# EAGLE board GDPHS_VGA - v2.2.1 (EAGLE 7.3.0), part 1 of 2
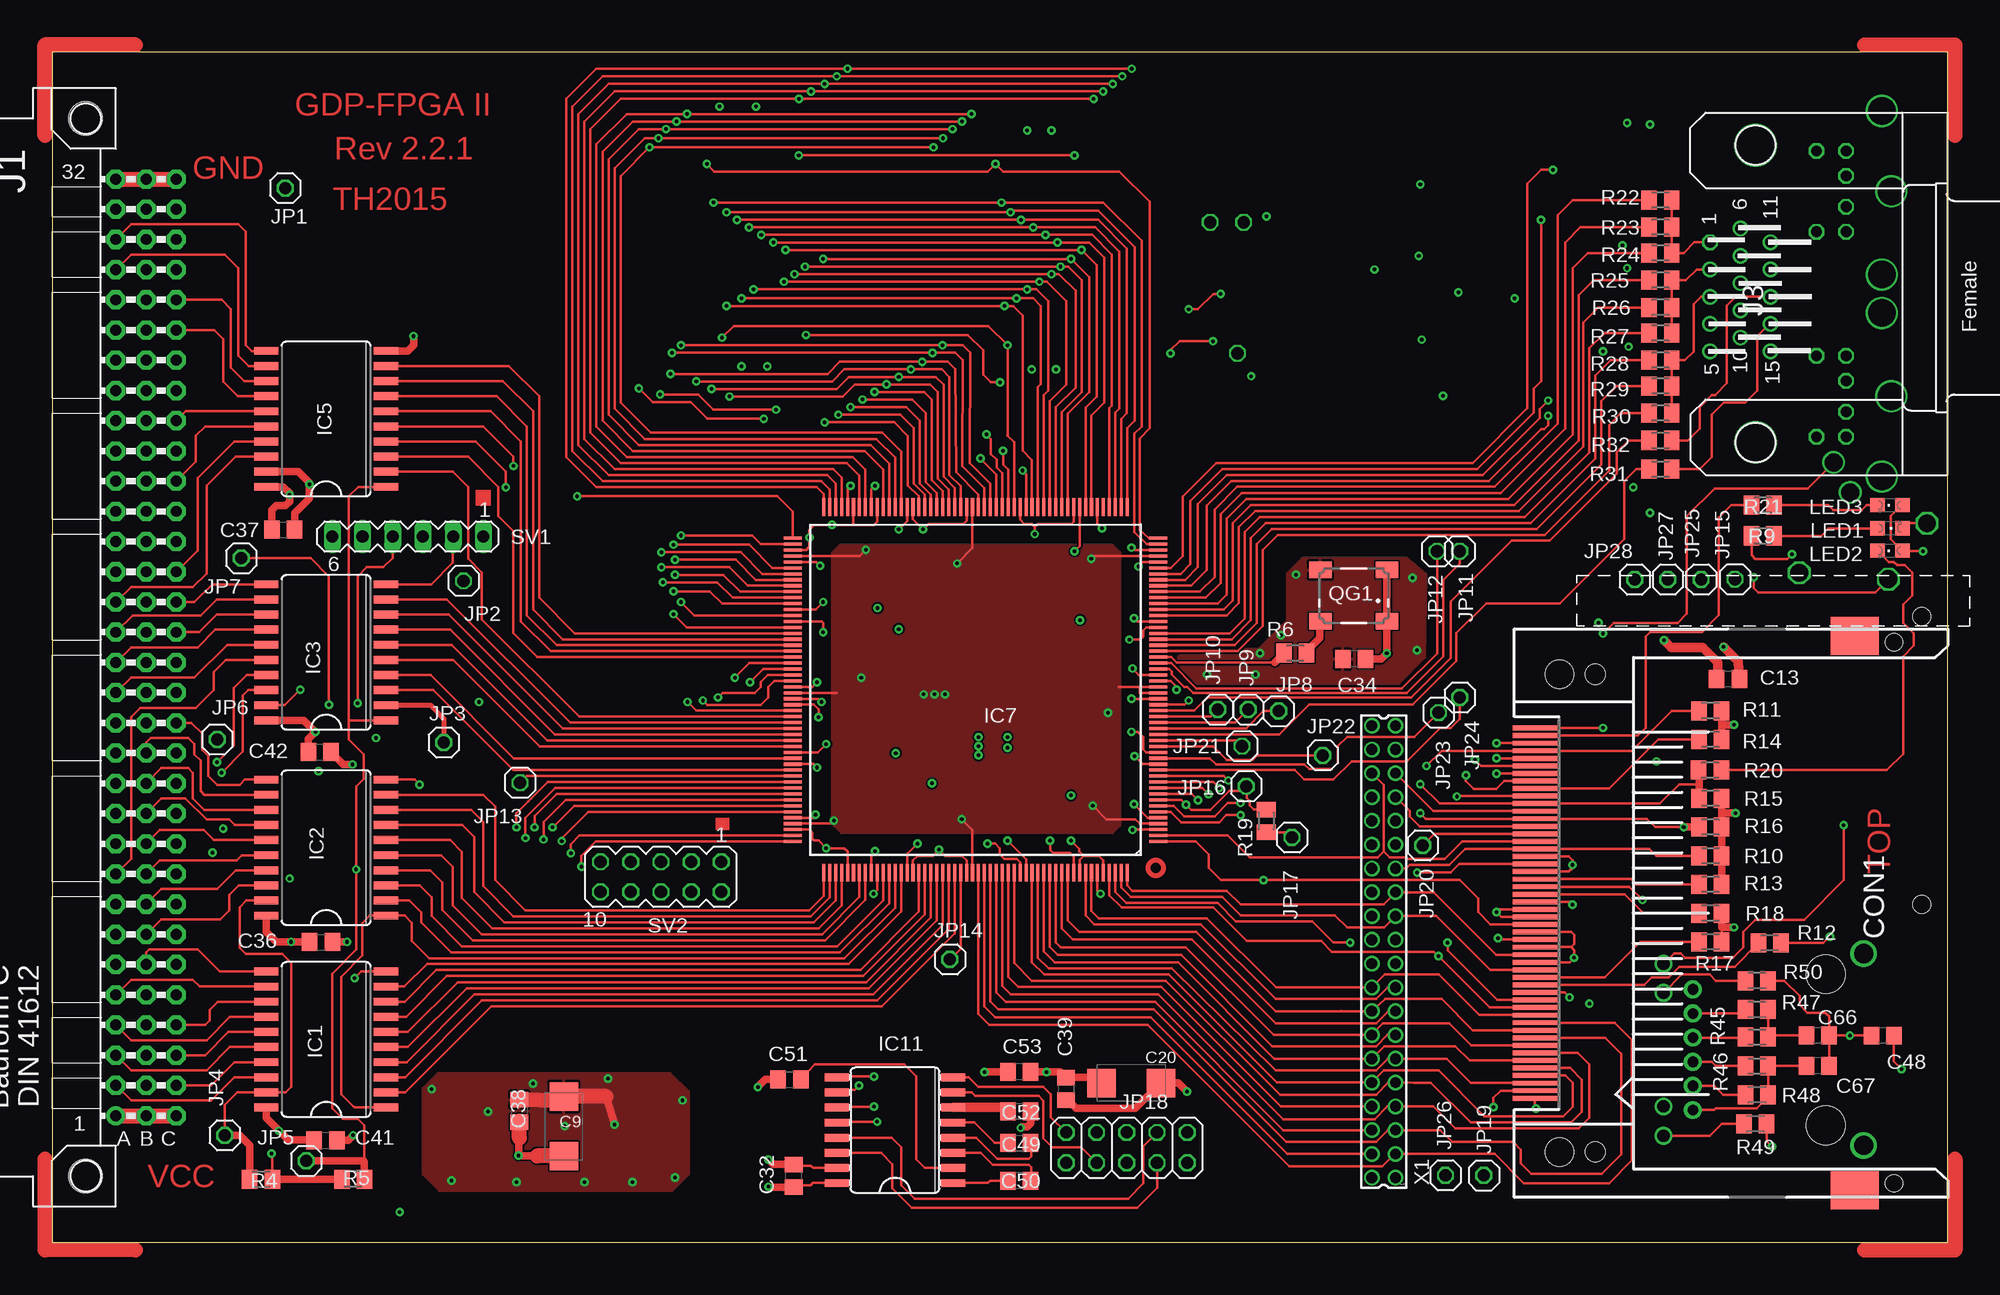
[diagram p5: board, top side]
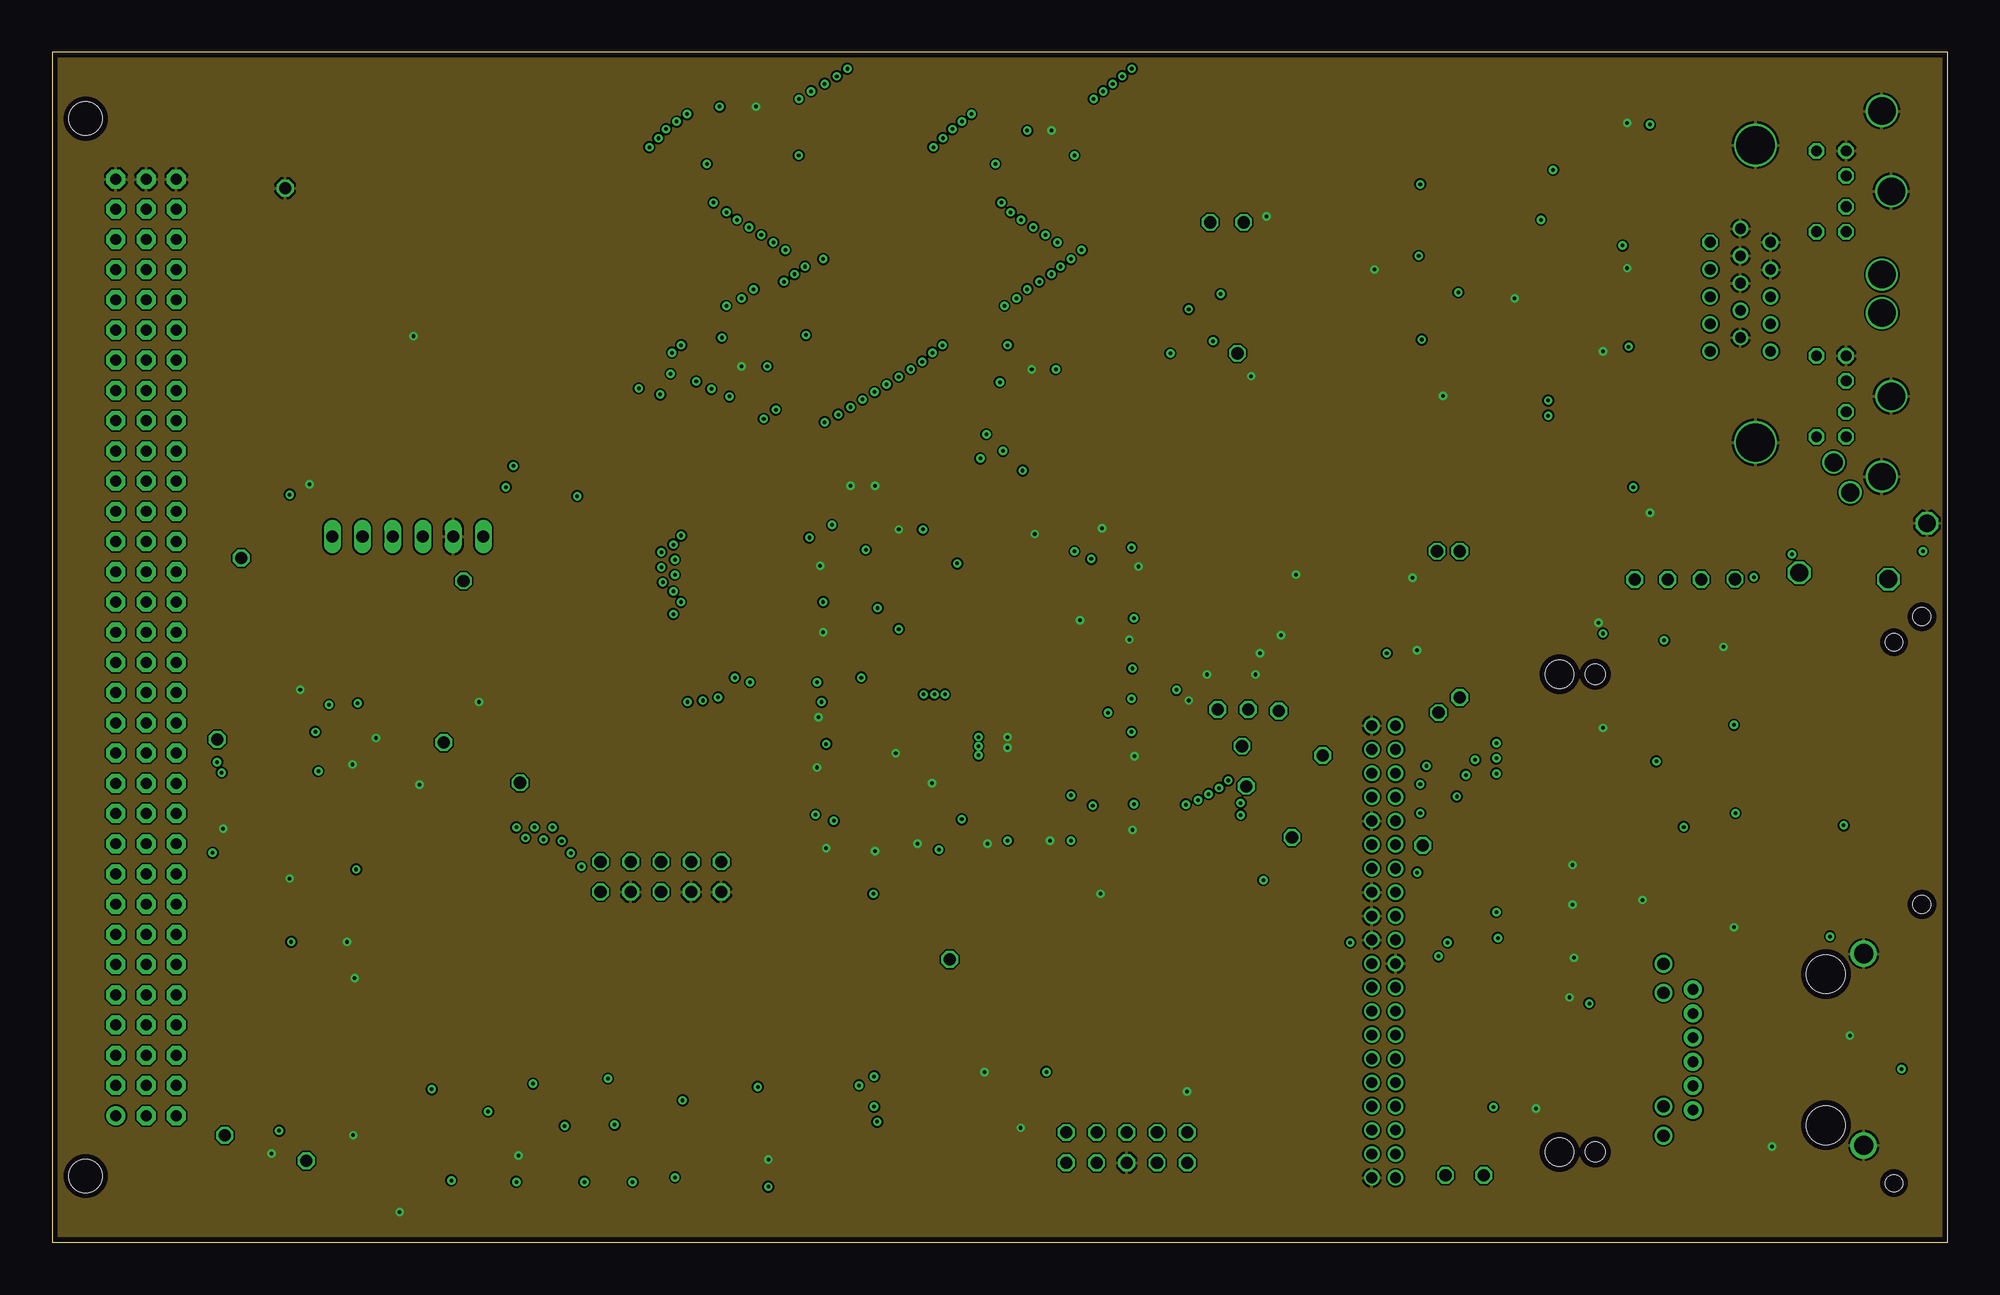
[diagram p6: board, inner layer GND$]
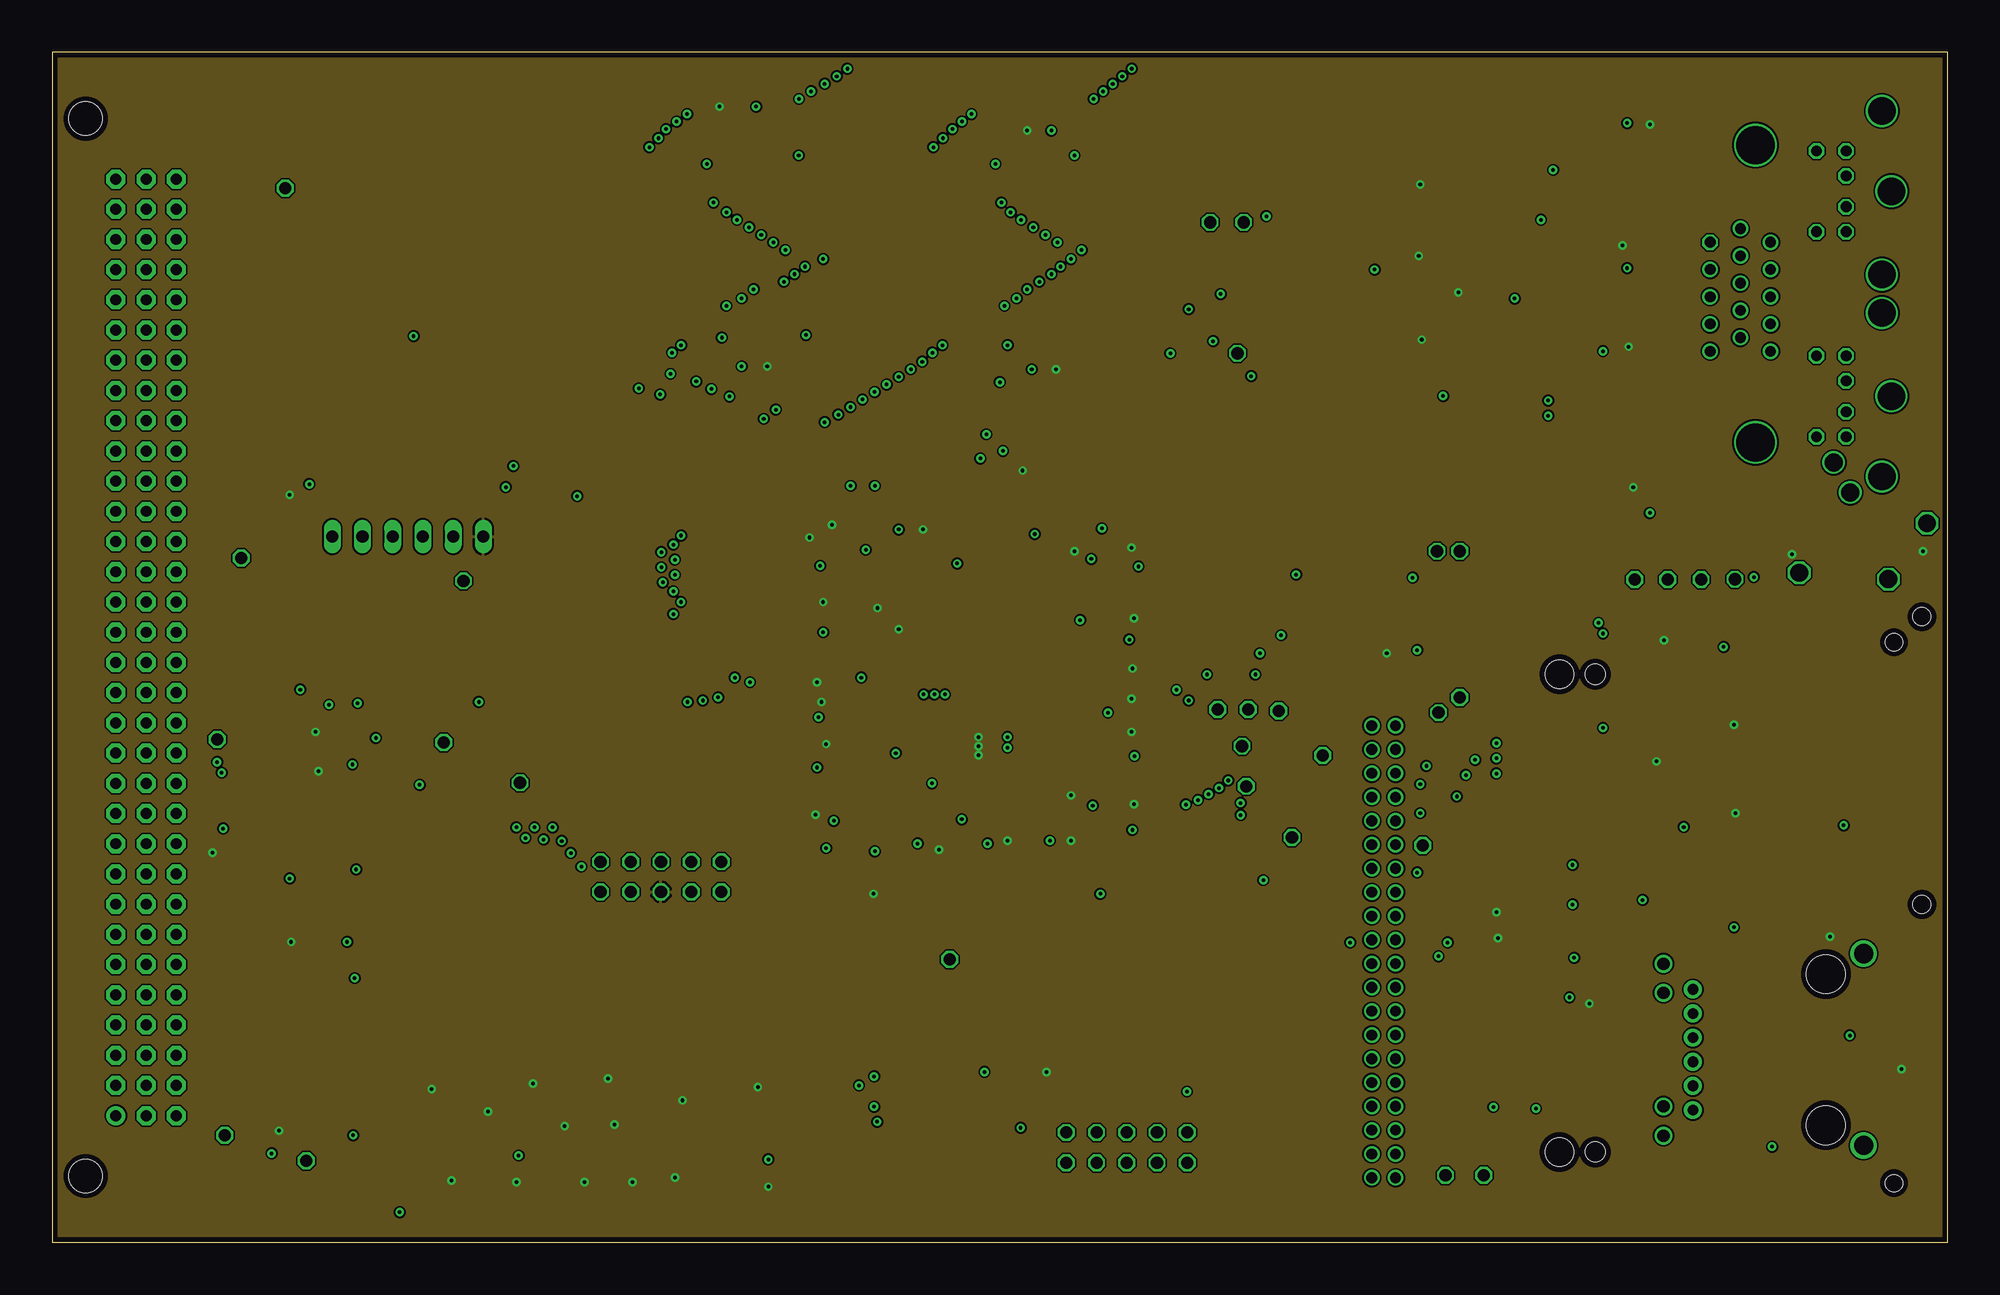
[diagram p7: board, inner layer VCC$]
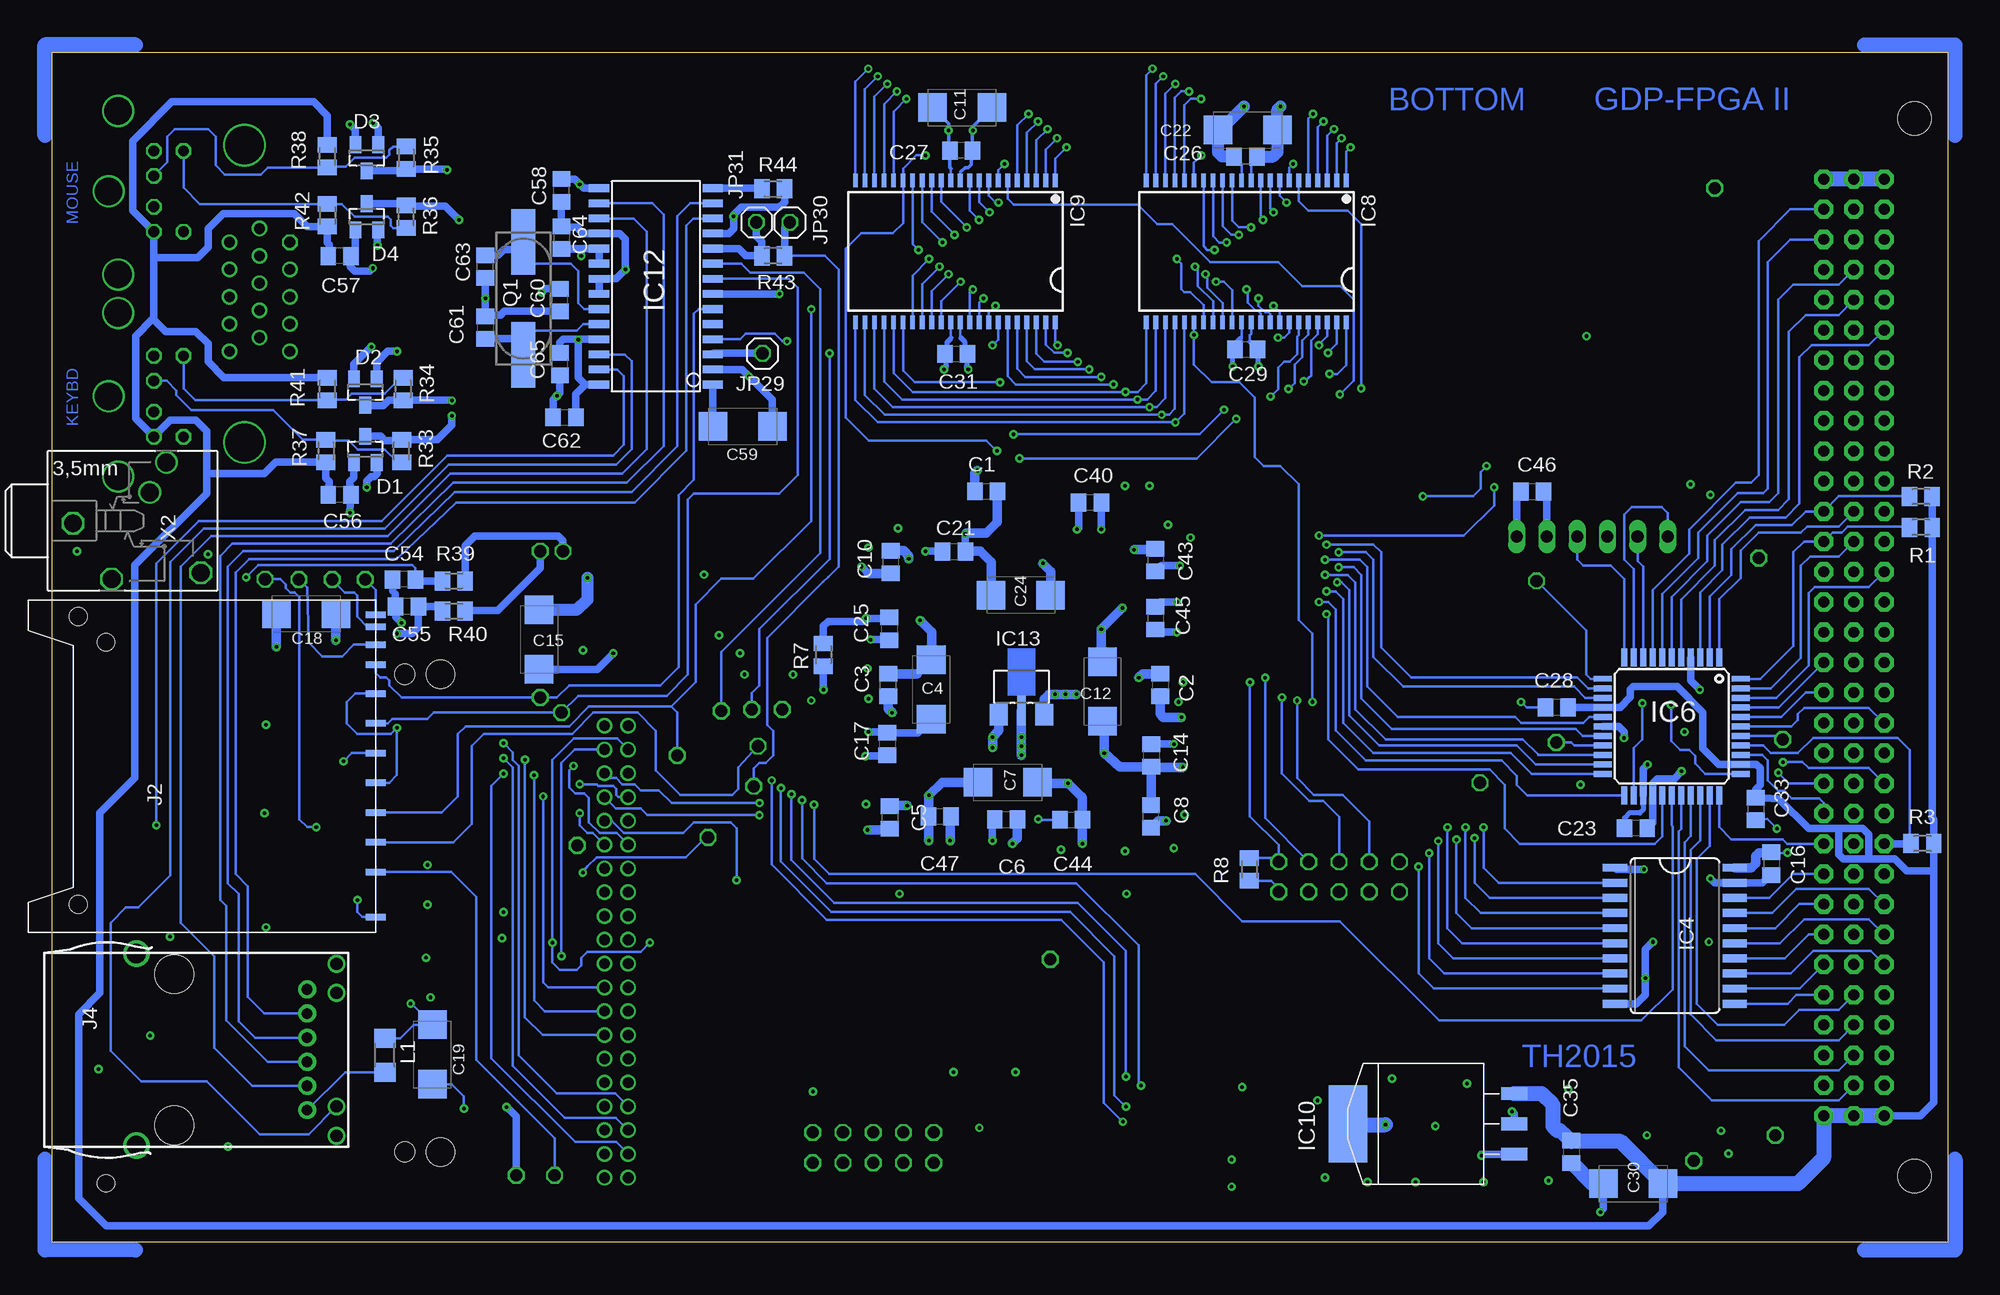
[diagram p8: board, bottom side, seen from below]

Size 159.26 x 100.03 mm. Coordinates in mm from the lower left corner, seen from the top.
Copper layers (1*2*3*16): Top 0.018mm / dielectric 0.36mm / GND$ 0.035mm / dielectric 0.71mm / VCC$ 0.035mm / dielectric 0.36mm / Bottom 0.018mm
Design rules "eC-PCB_proto-4-layer": minimum track width 0.15mm, minimum drill 0.25mm, track to track 0.15mm, track to pad 0.15mm, pad to pad 0.15mm, via to via 0.15mm, smd to smd 0.15mm, copper to edge 0.45mm, drill to drill 0.3mm, minimum pad ring 0.2mm, minimum via ring 0.2mm, stop-mask expansion 0.1mm, vias tented up to drill 0mil, thermal gap 0.2mm

## Footprints (pad centres in the part's own frame; a part is rotated, then mirrored left to right if it is on the bottom)
C0805 = smd 1.3 x 1.5: 1 -0.95,0; 2 0.95,0
SMC_C = smd 2.4 x 2.4: + -2.5,0; - 2.5,0
CF-050-P2-X03-10-DS-1 = smd 0.41 x 3.75: 1 15.557,0.27; 2 14.287,0.27; 3 13.018,0.27; 4 11.748,0.27; 5 10.477,0.27; 6 9.207,0.27; 7 7.938,0.27; 8 6.668,0.27; 9 5.397,0.27; 10 4.128,0.27; 11 2.857,0.27; 12 1.587,0.27; 13 0.318,0.27; 14 -0.953,0.27; 15 -2.223,0.27; 16 -3.493,0.27; 17 -4.763,0.27; 18 -6.032,0.27; 19 -7.303,0.27; 20 -8.572,0.27; 21 -9.842,0.27; 22 -11.113,0.27; 23 -12.383,0.27; 24 -13.652,0.27; 25 -14.922,0.27; 26 14.922,0.27; 27 13.652,0.27; 28 12.383,0.27; 29 11.113,0.27; 30 9.842,0.27; 31 8.572,0.27; 32 7.303,0.27; 33 6.032,0.27; 34 4.763,0.27; 35 3.493,0.27; 36 2.223,0.27; 37 0.953,0.27; 38 -0.318,0.27; 39 -1.587,0.27; 40 -2.857,0.27; 41 -4.128,0.27; 42 -5.397,0.27; 43 -6.668,0.27; 44 -7.938,0.27; 45 -9.207,0.27; 46 -10.477,0.27; 47 -11.748,0.27; 48 -13.018,0.27; 49 -14.287,0.27; 50 -15.557,0.27 | smd 3.2 x 4: M1 -23.3,27.15; M2 23.3,27.15 | hole 1.676: 20.08,5.35; -20.08,5.35 | hole 1.422: -22.77,30.45; 22.7,30.45 | hole 2.4: -20.08,2.35; 20.08,2.35
SOT23 = smd 1 x 1.4: 1 -0.95,-1.1; 2 0.95,-1.1; 3 0,1.1
SO20W = smd 0.66 x 2.032: 1 -5.715,-5.029; 2 -4.445,-5.029; 3 -3.175,-5.029; 4 -1.905,-5.029; 5 -0.635,-5.029; 6 0.635,-5.029; 7 1.905,-5.029; 8 3.175,-5.029; 9 4.445,-5.029; 10 5.715,-5.029; 11 5.715,5.029; 12 4.445,5.029; 13 3.175,5.029; 14 1.905,5.029; 15 0.635,5.029; 16 -0.635,5.029; 17 -1.905,5.029; 18 -3.175,5.029; 19 -4.445,5.029; 20 -5.715,5.029
TQFP44 = smd 1.5 x 0.5: 1 -5.8,4; 2 -5.8,3.2; 3 -5.8,2.4; 4 -5.8,1.6; 5 -5.8,0.8; 6 -5.8,0; 7 -5.8,-0.8; 8 -5.8,-1.6; 9 -5.8,-2.4; 10 -5.8,-3.2; 11 -5.8,-4; 23 5.8,-4; 24 5.8,-3.2; 25 5.8,-2.4; 26 5.8,-1.6; 27 5.8,-0.8; 28 5.8,0; 29 5.8,0.8; 30 5.8,1.6; 31 5.8,2.4; 32 5.8,3.2; 33 5.8,4 | smd 0.5 x 1.5: 12 -4,-5.8; 13 -3.2,-5.8; 14 -2.4,-5.8; 15 -1.6,-5.8; 16 -0.8,-5.8; 17 0,-5.8; 18 0.8,-5.8; 19 1.6,-5.8; 20 2.4,-5.8; 21 3.2,-5.8; 22 4,-5.8; 34 4,5.8; 35 3.2,5.8; 36 2.4,5.8; 37 1.6,5.8; 38 0.8,5.8; 39 0,5.8; 40 -0.8,5.8; 41 -1.6,5.8; 42 -2.4,5.8; 43 -3.2,5.8; 44 -4,5.8
PQFP_208 = smd 1.5 x 0.26: 1 -15.367,12.75; 2 -15.367,12.25; 3 -15.367,11.75; 4 -15.367,11.25; 5 -15.367,10.75; 6 -15.367,10.25; 7 -15.367,9.75; 8 -15.367,9.25; 9 -15.367,8.75; 10 -15.367,8.25; 11 -15.367,7.75; 12 -15.367,7.25; 13 -15.367,6.75; 14 -15.367,6.25; 15 -15.367,5.75; 16 -15.367,5.25; 17 -15.367,4.75; 18 -15.367,4.25; 19 -15.367,3.75; 20 -15.367,3.25; 21 -15.367,2.75; 22 -15.367,2.25; 23 -15.367,1.75; 24 -15.367,1.25; 25 -15.367,0.75; 26 -15.367,0.25; 27 -15.367,-0.25; 28 -15.367,-0.75; 29 -15.367,-1.25; 30 -15.367,-1.75; 31 -15.367,-2.25; 32 -15.367,-2.75; 33 -15.367,-3.25; 34 -15.367,-3.75; 35 -15.367,-4.25; 36 -15.367,-4.75; 37 -15.367,-5.25; 38 -15.367,-5.75; 39 -15.367,-6.25; 40 -15.367,-6.75; 41 -15.367,-7.25; 42 -15.367,-7.75; 43 -15.367,-8.25; 44 -15.367,-8.75; 45 -15.367,-9.25; 46 -15.367,-9.75; 47 -15.367,-10.25; 48 -15.367,-10.75; 49 -15.367,-11.25; 50 -15.367,-11.75; 51 -15.367,-12.25; 52 -15.367,-12.75; 105 15.367,-12.75; 106 15.367,-12.25; 107 15.367,-11.75; 108 15.367,-11.25; 109 15.367,-10.75; 110 15.367,-10.25; 111 15.367,-9.75; 112 15.367,-9.25; 113 15.367,-8.75; 114 15.367,-8.25; 115 15.367,-7.75; 116 15.367,-7.25; 117 15.367,-6.75; 118 15.367,-6.25; 119 15.367,-5.75; 120 15.367,-5.25; 121 15.367,-4.75; 122 15.367,-4.25; 123 15.367,-3.75; 124 15.367,-3.25; 125 15.367,-2.75; 126 15.367,-2.25; 127 15.367,-1.75; 128 15.367,-1.25; 129 15.367,-0.75; 130 15.367,-0.25; 131 15.367,0.25; 132 15.367,0.75; 133 15.367,1.25; 134 15.367,1.75; 135 15.367,2.25; 136 15.367,2.75; 137 15.367,3.25; 138 15.367,3.75; 139 15.367,4.25; 140 15.367,4.75; 141 15.367,5.25; 142 15.367,5.75; 143 15.367,6.25; 144 15.367,6.75; 145 15.367,7.25; 146 15.367,7.75; 147 15.367,8.25; 148 15.367,8.75; 149 15.367,9.25; 150 15.367,9.75; 151 15.367,10.25; 152 15.367,10.75; 153 15.367,11.25; 154 15.367,11.75; 155 15.367,12.25; 156 15.367,12.75 | smd 0.26 x 1.5: 53 -12.75,-15.367; 54 -12.25,-15.367; 55 -11.75,-15.367; 56 -11.25,-15.367; 57 -10.75,-15.367; 58 -10.25,-15.367; 59 -9.75,-15.367; 60 -9.25,-15.367; 61 -8.75,-15.367; 62 -8.25,-15.367; 63 -7.75,-15.367; 64 -7.25,-15.367; 65 -6.75,-15.367; 66 -6.25,-15.367; 67 -5.75,-15.367; 68 -5.25,-15.367; 69 -4.75,-15.367; 70 -4.25,-15.367; 71 -3.75,-15.367; 72 -3.25,-15.367; 73 -2.75,-15.367; 74 -2.25,-15.367; 75 -1.75,-15.367; 76 -1.25,-15.367; 77 -0.75,-15.367; 78 -0.25,-15.367; 79 0.25,-15.367; 80 0.75,-15.367; 81 1.25,-15.367; 82 1.75,-15.367; 83 2.25,-15.367; 84 2.75,-15.367; 85 3.25,-15.367; 86 3.75,-15.367; 87 4.25,-15.367; 88 4.75,-15.367; 89 5.25,-15.367; 90 5.75,-15.367; 91 6.25,-15.367; 92 6.75,-15.367; 93 7.25,-15.367; 94 7.75,-15.367; 95 8.25,-15.367; 96 8.75,-15.367; 97 9.25,-15.367; 98 9.75,-15.367; 99 10.25,-15.367; 100 10.75,-15.367; 101 11.25,-15.367; 102 11.75,-15.367; 103 12.25,-15.367; 104 12.75,-15.367; 157 12.75,15.367; 158 12.25,15.367; 159 11.75,15.367; 160 11.25,15.367; 161 10.75,15.367; 162 10.25,15.367; 163 9.75,15.367; 164 9.25,15.367; 165 8.75,15.367; 166 8.25,15.367; 167 7.75,15.367; 168 7.25,15.367; 169 6.75,15.367; 170 6.25,15.367; 171 5.75,15.367; 172 5.25,15.367; 173 4.75,15.367; 174 4.25,15.367; 175 3.75,15.367; 176 3.25,15.367; 177 2.75,15.367; 178 2.25,15.367; 179 1.75,15.367; 180 1.25,15.367; 181 0.75,15.367; 182 0.25,15.367; 183 -0.25,15.367; 184 -0.75,15.367; 185 -1.25,15.367; 186 -1.75,15.367; 187 -2.25,15.367; 188 -2.75,15.367; 189 -3.25,15.367; 190 -3.75,15.367; 191 -4.25,15.367; 192 -4.75,15.367; 193 -5.25,15.367; 194 -5.75,15.367; 195 -6.25,15.367; 196 -6.75,15.367; 197 -7.25,15.367; 198 -7.75,15.367; 199 -8.25,15.367; 200 -8.75,15.367; 201 -9.25,15.367; 202 -9.75,15.367; 203 -10.25,15.367; 204 -10.75,15.367; 205 -11.25,15.367; 206 -11.75,15.367; 207 -12.25,15.367; 208 -12.75,15.367
TSOP44-400 = smd 0.406 x 1.143: 1 -10.4,-5.969; 2 -9.6,-5.969; 3 -8.8,-5.969; 4 -8,-5.969; 5 -7.2,-5.969; 6 -6.4,-5.969; 7 -5.6,-5.969; 8 -4.8,-5.969; 9 -4,-5.969; 10 -3.2,-5.969; 11 -2.4,-5.969; 12 -1.6,-5.969; 13 -0.8,-5.969; 14 0,-5.969; 15 0.8,-5.969; 16 1.6,-5.969; 17 2.4,-5.969; 18 3.2,-5.969; 19 4,-5.969; 20 4.8,-5.969; 21 5.6,-5.969; 22 6.4,-5.969; 23 6.4,5.969; 24 5.6,5.969; 25 4.8,5.969; 26 4,5.969; 27 3.2,5.969; 28 2.4,5.969; 29 1.6,5.969; 30 0.8,5.969; 31 0,5.969; 32 -0.8,5.969; 33 -1.6,5.969; 34 -2.4,5.969; 35 -3.2,5.969; 36 -4,5.969; 37 -4.8,5.969; 38 -5.6,5.969; 39 -6.4,5.969; 40 -7.2,5.969; 41 -8,5.969; 42 -8.8,5.969; 43 -9.6,5.969; 44 -10.4,5.969
MDD = smd 1.067 x 2.184: 1 0,0; 2 2.54,0; 3 5.08,0 | smd 6.452 x 3.251: 4 2.54,13.97
SO16L = smd 0.66 x 2.032: 1 -4.445,-4.902; 2 -3.175,-4.902; 3 -1.905,-4.902; 4 -0.635,-4.902; 5 0.635,-4.902; 6 1.905,-4.902; 7 3.175,-4.902; 8 4.445,-4.902; 9 4.445,4.902; 10 3.175,4.902; 11 1.905,4.902; 12 0.635,4.902; 13 -0.635,4.902; 14 -1.905,4.902; 15 -3.175,4.902; 16 -4.445,4.902
SO28W = smd 0.65 x 1.7: 1 -7.62,-4.78; 2 -6.35,-4.78; 3 -5.08,-4.78; 4 -3.81,-4.78; 5 -2.54,-4.78; 6 -1.27,-4.78; 7 0,-4.78; 8 1.27,-4.78; 9 2.54,-4.78; 10 3.81,-4.78; 11 5.08,-4.78; 12 6.35,-4.78; 13 7.62,-4.78; 14 8.89,-4.78; 15 8.89,4.78; 16 7.62,4.78; 17 6.35,4.78; 18 5.08,4.78; 19 3.81,4.78; 20 2.54,4.78; 21 1.27,4.78; 22 0,4.78; 23 -1.27,4.78; 24 -2.54,4.78; 25 -3.81,4.78; 26 -5.08,4.78; 27 -6.35,4.78; 28 -7.62,4.78
SOT89-W = smd 1.5 x 1.8: 1 1.9,-2.1; 2 -1.9,-2.1 | smd 0.7 x 2.55: 4 0,-1.73
VG96K = drill 0.914 pad 1.6: A1 154.94,39.37 | drill 0.914 pad 1.6 octagon: A2 154.94,36.83; A3 154.94,34.29; A4 154.94,31.75; A5 154.94,29.21; A6 154.94,26.67; A7 154.94,24.13; A8 154.94,21.59; A9 154.94,19.05; A10 154.94,16.51; A11 154.94,13.97; A12 154.94,11.43; A13 154.94,8.89; A14 154.94,6.35; A15 154.94,3.81; A16 154.94,1.27; A17 154.94,-1.27; A18 154.94,-3.81; A19 154.94,-6.35; A20 154.94,-8.89; A21 154.94,-11.43; A22 154.94,-13.97; A23 154.94,-16.51; A24 154.94,-19.05; A25 154.94,-21.59; A26 154.94,-24.13; A27 154.94,-26.67; A28 154.94,-29.21; A29 154.94,-31.75; A30 154.94,-34.29; A31 154.94,-36.83; A32 154.94,-39.37; B1 152.4,39.37; B2 152.4,36.83; B3 152.4,34.29; B4 152.4,31.75; B5 152.4,29.21; B6 152.4,26.67; B7 152.4,24.13; B8 152.4,21.59; B9 152.4,19.05; B10 152.4,16.51; B11 152.4,13.97; B12 152.4,11.43; B13 152.4,8.89; B14 152.4,6.35; B15 152.4,3.81; B16 152.4,1.27; B17 152.4,-1.27; B18 152.4,-3.81; B19 152.4,-6.35; B20 152.4,-8.89; B21 152.4,-11.43; B22 152.4,-13.97; B23 152.4,-16.51; B24 152.4,-19.05; B25 152.4,-21.59; B26 152.4,-24.13; B27 152.4,-26.67; B28 152.4,-29.21; B29 152.4,-31.75; B30 152.4,-34.29; B31 152.4,-36.83; B32 152.4,-39.37; C1 149.86,39.37; C2 149.86,36.83; C3 149.86,34.29; C4 149.86,31.75; C5 149.86,29.21; C6 149.86,26.67; C7 149.86,24.13; C8 149.86,21.59; C9 149.86,19.05; C10 149.86,16.51; C11 149.86,13.97; C12 149.86,11.43; C13 149.86,8.89; C14 149.86,6.35; C15 149.86,3.81; C16 149.86,1.27; C17 149.86,-1.27; C18 149.86,-3.81; C19 149.86,-6.35; C20 149.86,-8.89; C21 149.86,-11.43; C22 149.86,-13.97; C23 149.86,-16.51; C24 149.86,-19.05; C25 149.86,-21.59; C26 149.86,-24.13; C27 149.86,-26.67; C28 149.86,-29.21; C29 149.86,-31.75; C30 149.86,-34.29; C31 149.86,-36.83; C32 149.86,-39.37 | hole 2.794: 157.48,44.45; 157.48,-44.45
FPS-009-2405-0 = smd 0.55 x 1.7: 1 2.5,0; 2 5,0; 3 7.5,0; 4 10,0; 5 12.5,0; 6 15,0; 7 17.43,0; 8 19.12,0; 9 0,0; CD 20.62,0; S1 -3.78,0; WP 21.62,0 | hole 1.5: -2.72,25; 21.48,25
MDSSV-BD06-HF15-B = drill 0.9 octagon: 1 4.331,12.311; 1-1 -7.314,0.881; 1-2 -9.915,0.881; 1-3 -5.213,0.881; 1-4 -12.015,0.881; 1-5 -5.213,3.381; 1-6 -12.015,3.381; 2-1 9.915,0.881; 2-2 7.314,0.881; 2-3 12.015,0.881; 2-4 5.213,0.881; 2-5 12.015,3.381; 2-6 5.213,3.381 | drill 0.9: 2 2.04,12.311; 3 -0.252,12.311; 4 -2.542,12.311; 5 -4.834,12.311; 6 5.476,9.771; 7 3.185,9.771; 8 0.894,9.771; 9 -1.397,9.771; 10 -3.688,9.771; 11 4.331,7.231; 12 2.04,7.231; 13 -0.252,7.231; 14 -2.542,7.231; 15 -4.834,7.231 | drill 2.301: S1 -15.367,-2.118; S2 -8.616,-2.918; S3 8.616,-2.918; S4 15.367,-2.118; S7 -1.615,-2.118; S8 1.615,-2.118 | drill 3.2: S5 12.495,8.501; S6 -12.495,8.501
08B0-1X1T-36-F = drill 0.9 pad 1.5: 1 0,0; 2 2.03,0; 3 4.06,0; 4 6.09,0; 5 8.12,0; 6 10.15,0 | drill 1.02 pad 1.5: 7 -2.15,-2.47; 8 0.3,-2.47; 9 9.85,-2.47; 10 12.3,-2.47 | drill 1.6 pad 2.2: S1 13.15,14.34; S2 -2.98,14.34 | hole 3.251: 11.43,11.17; -1.27,11.17
1X01 = drill 1.016 octagon: 1 0,0
2X05 = drill 1.016 octagon: 1 -5.08,-1.27; 2 -5.08,1.27; 3 -2.54,-1.27; 4 -2.54,1.27; 5 0,-1.27; 6 0,1.27; 7 2.54,-1.27; 8 2.54,1.27; 9 5.08,-1.27; 10 5.08,1.27
L1206 = smd 1.6 x 1.803: 1 -1.422,0; 2 1.422,0
CHIPLED_0805 = smd 1.2 x 1.2: A 0,-1.05; C 0,1.05
CSM-7X-DU = smd 5.5 x 2: 1 -4.75,0; 2 4.75,0
CFPS7X = smd 1.9 x 1.4: 1 -2.794,-2.794; 4 2.794,-2.794; 5 2.794,1.524; 8 -2.794,1.524
M0805 = smd 1.3 x 1.6: 1 -0.95,0; 2 0.95,0
MA06-1 = drill 1.016 long: 1 -6.35,0; 2 -3.81,0; 3 -1.27,0; 4 1.27,0; 5 3.81,0; 6 6.35,0
MA05-2 = drill 1.016 octagon: 1 -5.08,-1.27; 2 -5.08,1.27; 3 -2.54,-1.27; 4 -2.54,1.27; 5 0,-1.27; 6 0,1.27; 7 2.54,-1.27; 8 2.54,1.27; 9 5.08,-1.27; 10 5.08,1.27
87758-4016 = drill 0.9 pad 1.27: 1 -19,-1; 2 -19,1; 3 -17,-1; 4 -17,1; 5 -15,-1; 6 -15,1; 7 -13,-1; 8 -13,1; 9 -11,-1; 10 -11,1; 11 -9,-1; 12 -9,1; 13 -7,-1; 14 -7,1; 15 -5,-1; 16 -5,1; 17 -3,-1; 18 -3,1; 19 -1,-1; 20 -1,1; 21 1,-1; 22 1,1; 23 3,-1; 24 3,1; 25 5,-1; 26 5,1; 27 7,-1; 28 7,1; 29 9,-1; 30 9,1; 31 11,-1; 32 11,1; 33 13,-1; 34 13,1; 35 15,-1; 36 15,1; 37 17,-1; 38 17,1; 39 19,-1; 40 19,1
PG203J = drill 1.499 octagon: 1 -5.004,-0.203; 4 5.74,-4.369; 5 -1.753,-4.902 | drill 1.499: 2 2.845,4.902; 3 1.448,2.388

## Placement (x,y rotation side)
C1  100n  [C0805]  80.79,63.13 0 bottom
C2  100n  [C0805]  66.17,46.84 270 bottom
C3  100n  [C0805]  89.02,46.84 90 bottom
C4  10µ/16  [SMC_C]  85.4,46.47 90 bottom
C5  100n  [C0805]  88.9,35.71 270 bottom
C6  100n  [C0805]  79.12,35.53 0 bottom
C7  10µ/16  [SMC_C]  78.97,38.66 0 bottom
C8  100n  [C0805]  66.93,35.79 90 bottom
C9  10µ/16  [SMC_C]  42.98,9.76 270 top
C10  100n  [C0805]  88.82,57.18 270 bottom
C11  10µ/16  [SMC_C]  82.82,95.39 180 bottom
C12  10µ/16  [SMC_C]  71.02,46.31 270 bottom
C13  100n  [C0805]  140.81,47.36 0 top
C14  100n  [C0805]  66.92,40.92 270 bottom
C15  10µ/16  [SMC_C]  118.36,50.67 90 bottom
C16  100n  [C0805]  14.81,31.82 270 bottom
C17  100n  [C0805]  89.1,41.88 270 bottom
C18  10µ/16  [SMC_C]  137.93,52.83 180 bottom
C19  10µ/16  [SMC_C]  127.33,15.78 270 bottom
C20  10µ/16  [SMC_C]  90.66,13.39 0 top
C21  100n  [C0805]  83.5,58.06 0 bottom
C22  10µ/16  [SMC_C]  58.81,93.5 180 bottom
C23  100n  [C0805]  26.19,34.81 180 bottom
C24  10µ/16  [SMC_C]  77.87,54.4 180 bottom
C25  100n  [C0805]  88.94,51.57 270 bottom
C26  100n  [C0805]  59,91.27 180 bottom
C27  100n  [C0805]  82.89,91.78 180 bottom
C28  100n  [C0805]  32.84,44.95 180 bottom
C29  100n  [C0805]  58.94,75.06 0 bottom
C30  10µ/16  [SMC_C]  26.42,4.93 180 bottom
C31  100n  [C0805]  83.31,74.68 0 bottom
C32  100n  [C0805]  62.3,5.58 90 top
C33  100n  [C0805]  16.13,36.42 270 bottom
C34  100n  [C0805]  109.4,49.03 180 top
C35  100n  [C0805]  31.62,7.59 270 bottom
C36  100n  [C0805]  22.57,25.24 0 top
C37  100n  [C0805]  19.41,59.9 0 top
C38  100n  [C0805]  39.23,11.03 270 top
C39  100n  [C0805]  85.18,12.89 270 top
C40  100n  [C0805]  72.07,62.19 0 bottom
C41  100n  [C0805]  22.95,8.57 0 top
C42  100n  [C0805]  22.46,41.21 0 top
C43  100n  [C0805]  66.57,57.35 270 bottom
C44  100n  [C0805]  73.65,35.52 0 bottom
C45  100n  [C0805]  66.57,52.46 270 bottom
C46  100n  [C0805]  34.9,63.11 0 bottom
C47  100n  [C0805]  84.7,35.81 0 bottom
C48  100n  [C0805]  153.8,17.37 180 top
C49  100n  [C0805]  81.25,8.35 0 top
C50  100n  [C0805]  81.25,5.17 180 top
C51  100n  [C0805]  61.94,13.68 0 top
C52  100n  [C0805]  81.25,11.01 0 top
C53  100n  [C0805]  81.25,14.32 180 top
C54  4n7  [C0805]  129.72,55.73 180 bottom
C55  4n7  [C0805]  129.46,53.44 180 bottom
C56  100n  [C0805]  135.13,62.84 180 bottom
C57  100n  [C0805]  135.13,82.91 180 bottom
C58  100n  [C0805]  116.48,88.42 90 bottom
C59  10µ/16  [SMC_C]  101.25,68.58 0 bottom
C60  100n  [C0805]  116.61,79.21 90 bottom
C61  22p  [C0805]  122.88,76.9 270 bottom
C62  100n  [C0805]  116.22,69.35 0 bottom
C63  22p  [C0805]  122.88,82.02 90 bottom
C64  100n  [C0805]  116.48,84.45 270 bottom
C65  100n  [C0805]  116.61,73.83 90 bottom
C66  100n  [C0805]  148.35,17.38 180 top
C67  100n  [C0805]  148.35,14.82 180 top
CON1  IDE  [CF-050-P2-X03-10-DS-1]  124.31,27.67 270 top
D1  BAT54S  [SOT23]  132.97,66.65 0 bottom
D2  BAT54S  [SOT23]  132.97,71.48 180 bottom
D3  BAT54S  [SOT23]  132.84,91.16 180 bottom
D4  BAT54S  [SOT23]  132.84,86.21 0 bottom
IC1  74LVC245  [SO20W]  23,17.05 90 top
IC2  74LVC245  [SO20W]  23,33.17 90 top
IC3  74LVC245  [SO20W]  23,49.59 90 top
IC4  74LVC245  [SO20W]  22.91,25.77 270 bottom
IC5  74LVC245  [SO20W]  23,69.22 90 top
IC6  XC9536SMD  [TQFP44]  23.18,43.37 270 bottom
IC7  LFXP2C_XX208-2  [PQFP_208]  77.57,46.44 180 top
IC8  IS64WV51216TSOP44  [TSOP44-400]  60.93,83.3 180 bottom
IC9  IS64WV51216TSOP44  [TSOP44-400]  85.38,83.3 180 bottom
IC10  LT1086-3.3V  [MDD]  36.42,7.41 90 bottom
IC11  MAX232ECWE  [SO16L]  70.8,9.43 90 top
IC12  ENC28J60SOIC28W  [SO28W]  108.54,79.72 90 bottom
IC13  MCP170XSOT89  [SOT89-W]  77.82,46.44 0 bottom
J1  ECB-BUS  [VG96K]  160.27,50.01 180 top
J2  FPS-009-2405-0  [FPS-009-2405-0]  132.1,31.12 90 bottom
J3  MDSSV-BD06-HF15B  [MDSSV-BD06-HF15-B]  151.62,79.73 90 top
J4  [08B0-1X1T-36-F]  137.86,11.11 90 bottom
JP1  [1X01]  19.56,88.62 0 top
JP2  [1X01]  34.54,55.6 0 top
JP3  [1X01]  32.89,42.01 0 top
JP4  [1X01]  14.48,8.99 0 top
JP5  [1X01]  21.34,6.83 0 top
JP6  [1X01]  13.84,42.27 0 top
JP7  [1X01]  15.88,57.51 0 top
JP8  [1X01]  103.04,44.65 0 top
JP9  [1X01]  100.48,44.77 0 top
JP10  [1X01]  97.92,44.77 0 top
JP11  [1X01]  118.27,58.09 0 top
JP12  [1X01]  116.35,58.09 0 top
JP13  [1X01]  39.3,38.63 0 top
JP14  [1X01]  75.42,23.78 0 top
JP15  [1X01]  141.39,55.73 0 top
JP16  [1X01]  100.32,38.33 0 top
JP17  [1X01]  104.16,34.04 0 top
JP18  RS232  [2X05]  90.28,7.95 0 top
JP19  [1X01]  120.29,5.62 0 top
JP20  [1X01]  115.15,33.36 0 top
JP21  [1X01]  99.97,41.7 0 top
JP22  [1X01]  106.75,40.93 0 top
JP23  [1X01]  116.48,44.52 0 top
JP24  [1X01]  118.27,45.8 0 top
JP25  [1X01]  138.54,55.71 0 top
JP26  [1X01]  117.06,5.64 0 top
JP27  [1X01]  135.75,55.71 0 top
JP28  [1X01]  132.96,55.71 0 top
JP29  [1X01]  99.58,74.73 90 bottom
JP30  [1X01]  97.28,85.73 90 bottom
JP31  [1X01]  100.1,85.73 0 bottom
L1  [L1206]  131.33,15.72 270 bottom
LED1  GREEN  [CHIPLED_0805]  154.42,60.03 270 top
LED2  RED  [CHIPLED_0805]  154.42,58.14 90 top
LED3  YELLOW  [CHIPLED_0805]  154.42,61.96 90 top
Q1  CSM-7X-DU 25MHz  [CSM-7X-DU]  119.68,79.33 90 bottom
QG1  CFPS32 - 40MHz  [CFPS7X]  109.34,53.72 180 top
R1  10k  [M0805]  2.24,60.1 0 bottom
R2  10k  [M0805]  2.24,62.67 0 bottom
R3  10k  [M0805]  2.11,33.52 0 bottom
R4  0  [M0805]  17.53,5.31 180 top
R5  0  [M0805]  25.27,5.31 0 top
R6  330  [M0805]  104.44,49.52 0 top
R7  4k7  [M0805]  94.46,49.38 90 bottom
R8  4k7  [M0805]  58.67,31.34 90 bottom
R9  270  [M0805]  143.74,59.39 180 top
R10  10k  [M0805]  139.32,32.49 0 top
R11  10k  [M0805]  139.32,44.68 0 top
R12  10k  [M0805]  144.31,25.15 0 top
R13  10k  [M0805]  139.32,30.07 0 top
R14  10k  [M0805]  139.32,42.27 0 top
R15  10k  [M0805]  139.32,37.31 0 top
R16  0  [M0805]  139.32,34.9 0 top
R17  10k  [M0805]  139.32,25.26 0 top
R18  10k  [M0805]  139.32,27.66 0 top
R19  0  [M0805]  101.99,35.41 90 top
R20  270  [M0805]  139.3,39.69 0 top
R21  270  [M0805]  143.74,61.96 0 top
R22  470  [M0805]  135.13,87.6 0 top
R23  1k  [M0805]  135.13,85.32 0 top
R24  1k8  [M0805]  135.13,83.16 0 top
R25  470  [M0805]  135.13,80.87 0 top
R26  1k  [M0805]  135.13,78.59 0 top
R27  1k8  [M0805]  135.13,76.43 0 top
R28  470  [M0805]  135.13,74.14 0 top
R29  1k  [M0805]  135.13,71.98 0 top
R30  1k8  [M0805]  135.13,69.7 0 top
R31  47  [M0805]  135.13,65 180 top
R32  47  [M0805]  135.13,67.41 180 top
R33  120  [M0805]  129.92,66.52 270 bottom
R34  120  [M0805]  129.79,71.73 90 bottom
R35  120  [M0805]  129.54,91.16 90 bottom
R36  120  [M0805]  129.54,86.21 270 bottom
R37  2k  [M0805]  136.27,66.52 90 bottom
R38  2k  [M0805]  136.14,91.29 270 bottom
R39  3k3  [M0805]  125.53,55.6 180 bottom
R40  3k3  [M0805]  125.53,53.06 180 bottom
R41  2k  [M0805]  136.14,71.73 270 bottom
R42  2k  [M0805]  136.14,86.33 90 bottom
R43  0  [M0805]  98.69,82.92 0 bottom
R44  2k7  [M0805]  98.69,88.55 180 bottom
R45  50  [M0805]  143.23,17.25 180 top
R46  50  [M0805]  143.23,14.82 180 top
R47  50  [M0805]  143.23,19.56 0 top
R48  50  [M0805]  143.23,12.39 0 top
R49  270  [M0805]  143.1,9.96 0 top
R50  270  [M0805]  143.23,21.99 0 top
SV1  XilinxProg  [MA06-1]  29.87,59.32 180 top
SV2  LatticeProg  [MA05-2]  51.14,30.72 180 top
X1  87758-4016  [87758-4016]  111.87,24.42 90 top
X2  PG203J  [PG203J]  152.53,60.65 0 bottom

## Tracks (layer width: path | path; a pad name or v marks a point on that pad's centre or on a via)
$34
  Bottom 0.2: IC6.38 14.15,42.57 JP6.1
+5V
  Top 1.27: J1.A1 J1.C1
  Bottom 0.2: 32.55,9.37 32.77,9.37
  Bottom 0.61: 1.16,31.22 R3.2 1.16,35.55 1.27,35.66 1.27,60.05 | 1.16,31.22 1.16,11.77 2.29,10.64 J1.A1 | 9.14,34.77 7.11,34.77 6.6,34.26 6.6,32.23 | 9.14,34.77 11.68,34.77 14.19,37.27 C33.1 16.13,38.07 15.75,38.46 15.75,39.85 16.07,40.17 IC6.35 19.24,40.17 20.57,41.5 20.57,44.55 22.73,46.71 26.42,46.71 26.67,46.46 26.67,45.82 27.52,44.97 IC6.15 31.08,44.97 C28.1 | 1.16,31.22 3.43,31.22 4.45,32.23 6.6,32.23 | 9.14,34.77 9.14,32.61 8.76,32.23 6.6,32.23 | C57.2 135.98,83.88 136.14,84.05 R42.1 137.86,85.38 138.94,86.46 144.91,86.46 146.18,85.19 146.18,83.67 147.07,82.78 150.74,82.78 | R37.1 138.87,65.57 | R37.1 136.27,64.24 135.98,63.94 C56.2 | R2.2 1.29,60.07 1.27,60.05 | 1.27,60.05 1.27,60.08 R1.2 | 150.74,82.78 J3.2-4 152.53,86.74 152.53,92.56 149.22,95.86 137.29,95.86 136.14,94.72 R38.1 | 150.74,82.78 150.74,77.71 150.81,77.63 | 150.81,77.63 152.27,76.17 152.27,69.25 J3.1-4 149.36,69.09 147.2,69.09 146.3,68.2 146.3,64.61 | R41.1 144.84,72.68 146.18,74.02 146.18,75.54 147.19,76.56 149.73,76.56 150.81,77.63 | C30.+ 23.94,4.91 23.94,2.53 25.1,1.37 154.74,1.37 157.06,3.69 157.06,19.17 155.26,20.97 155.26,36.07 152.32,39.01 152.32,56.93 146.3,62.95 146.3,64.61 | R37.1 140.48,65.57 141.44,64.61 146.3,64.61
  Bottom 1.27: IC10.3 34.1,12.49 33.15,11.53 33.15,9.75 32.77,9.37 | 32.55,9.37 C35.1 31.58,8.48 27.47,8.48 C30.+ 12.57,4.93 10.41,7.09 J1.C1 J1.B1 J1.A1
/INT
  Bottom 0.2: R2.1 2.98,62.71 9.14,62.71 J1.C21 11.94,61.44 13.08,60.3 16.13,60.3 18.16,58.27 18.16,56.11 19.98,54.28 IC6.2
/NMI
  Bottom 0.2: R1.1 3.01,60.17 8.38,60.17 8.89,59.66 9.65,59.66 J1.C20 12.06,58.9 12.95,58.01 12.95,50.14 15.72,47.37 IC6.44
/WAIT
  Bottom 0.2: R3.1 3.08,33.5 3.17,33.5 3.17,41.38 4.19,42.39 11.3,42.39 12.57,41.12 14.86,41.12 15.51,41.77 IC6.37
  Bottom 0.61: 3.17,33.5 J1.A10
A0  (via drill 0.3)
  Top 0.2: v44.45,31.57 44.45,32.46 45.68,33.69 IC7.156
  Bottom 0.2: v44.45,31.57 44.45,22.59 43.18,21.32 IC4.9
A1  (via drill 0.3)
  Top 0.2: IC7.150 43.85,36.69 v42.04,34.87
  Bottom 0.2: v42.04,34.87 42.04,26.4 40.77,25.13 IC4.6
A2  (via drill 0.3)
  Top 0.2: v42.8,33.73 42.8,33.96 45.02,36.19 IC7.151
  Bottom 0.2: v42.8,33.73 42.8,25.13 41.53,23.86 IC4.7
A3  (via drill 0.3)
  Top 0.2: v43.56,32.72 43.56,33.46 44.29,34.19 IC7.155
  Bottom 0.2: v43.56,32.72 43.56,23.86 42.29,22.59 IC4.8
A4  (via drill 0.3)
  Top 0.2: v41.27,33.86 41.27,35.33 43.14,37.19 IC7.149
  Bottom 0.2: v41.27,33.86 41.27,27.67 40.01,26.4 IC4.5
A5  (via drill 0.3)
  Top 0.2: v39.75,33.99 39.75,35.68 42.26,38.19 IC7.147
  Bottom 0.2: v39.75,33.99 39.75,30.21 38.48,28.94 IC4.3
A6
  Top 0.2: IC3.4 31.79,47.69 38.79,40.69 IC7.142
A7  (via drill 0.3)
  Top 0.2: v38.99,34.87 38.99,36.06 39.98,37.05 40.26,37.33 41.62,38.69 IC7.146
  Bottom 0.2: v38.99,34.87 38.99,31.48 37.72,30.21 IC4.2
A8  (via drill 0.3)
  Top 0.2: v40.51,34.87 40.51,35.83 42.37,37.69 IC7.148
  Bottom 0.2: v40.51,34.87 40.51,28.94 39.24,27.67 IC4.4
A9
  Top 0.2: IC5.9 38.35,73.66 40.89,71.12 40.89,54.2 43.91,51.19 IC7.121
A10
  Top 0.2: IC3.9 33.15,54.04 43.5,43.69 IC7.136
A11
  Top 0.2: IC3.7 33.42,51.5 42.23,42.69 IC7.138
A12
  Top 0.2: IC5.6 36.83,69.85 39.37,67.31 39.37,52.2 41.88,49.69 IC7.124
A13
  Top 0.2: IC5.8 37.85,72.39 40.39,69.85 40.39,53.2 42.9,50.69 IC7.122
A14
  Top 0.2: IC5.2 33.66,64.77 34.92,63.5 34.92,57.47 36.1,56.29 36.1,52.35 44.26,44.19 IC7.135
A15
  Top 0.2: IC5.7 37.34,71.12 39.88,68.58 39.88,52.7 42.39,50.19 IC7.123
A16
  Top 0.2: IC5.3 34.92,66.04 37.47,63.5 37.47,61.06 38.73,59.79 38.73,51.2 40.75,49.19 IC7.125
A17
  Top 0.2: IC3.8 33.29,52.77 42.87,43.19 IC7.137
A18
  Top 0.2: IC3.3 32,46.42 38.72,39.69 IC7.144
A19
  Top 0.406: IC3.2 31.75,45.15 32.9,44.01 JP3.1
  Bottom 0.2: IC6.19 31.38,41.77 31.62,42.01 JP3.1
AUDIO_L
  Top 0.2: IC7.30 93.87,48.19 94.08,47.97 94.08,47.72 95.1,46.69 95.36,46.69 95.87,46.18 113.79,46.18 116.86,49.25 116.86,55.65 118.27,57.06 JP11.1
  Bottom 0.2: R40.1 124.54,53.09
  Bottom 0.61: 124.54,53.09 121.86,53.09 118.27,56.68 JP11.1
AUDIO_R
  Top 0.2: IC7.31 94.01,48.69 96.13,46.57 113.41,46.57 116.35,49.51 JP12.1
  Bottom 0.61: R39.1 124.58,58.57 123.78,59.37 116.74,59.37 116.35,58.98 JP12.1
B_020_A0
  Top 0.2: IC3.15 14.69,50.23 11.94,47.47 6.6,47.47 J1.A15
B_020_A1
  Top 0.2: IC3.14 13.68,51.5 12.19,50.01 6.6,50.01 J1.A16
B_A0
  Bottom 0.2: IC4.11 13.45,20.05 12.7,20.8 J1.C5
B_A1
  Bottom 0.2: IC4.14 13.7,23.86 11.68,25.88 J1.C7
B_A2
  Bottom 0.2: IC4.13 13.2,22.59 11.3,24.49 6.48,24.49 J1.A6
B_A3
  Bottom 0.2: IC4.12 12.43,21.32 J1.C6
B_A4
  Bottom 0.2: IC4.15 14.08,25.13 12.06,27.15 6.6,27.15 J1.A7
B_A5
  Bottom 0.2: IC4.17 14.72,27.67 12.7,29.69 6.6,29.69 J1.A8
B_A6
  Top 0.2: J1.A9 6.6,32.23 6.6,44.17 7.37,44.93 12.06,44.93 13.55,46.42 13.55,47.94 14.57,48.96 IC3.16
B_A7
  Bottom 0.2: IC4.18 14.97,28.94 12.95,30.96 J1.C9
B_A8
  Bottom 0.2: IC4.16 14.46,26.4 12.45,28.42 J1.C8
B_A9
  Top 0.2: IC5.11 16.74,74.93 16.26,75.41 16.26,84.94 15.62,85.57 6.6,85.57 J1.A30
B_A10
  Top 0.2: IC3.11 13.42,55.31 11.94,53.82 J1.C18
B_A11
  Top 0.2: IC3.13 13.8,52.77 12.32,51.28 J1.C17
B_A12
  Top 0.2: IC5.14 15.59,71.12 14.35,72.36 14.35,75.92 13.59,76.68 J1.C27
B_A13
  Top 0.2: IC5.12 16.48,73.66 15.62,74.52 15.62,81.89 14.48,83.03 6.6,83.03 J1.A29
B_A14
  Top 0.2: IC5.18 15.39,66.04 12.95,63.6 12.95,56.24 11.81,55.09 6.6,55.09 J1.A18
B_A15
  Top 0.2: IC5.13 16.1,72.39 14.99,73.51 14.99,78.46 14.22,79.22 J1.C28
B_A16
  Top 0.2: IC5.17 15.27,67.31 12.19,64.24 12.19,58.14 J1.C19
B_A17
  Top 0.2: IC3.12 13.8,54.04 12.45,52.68 6.73,52.68 J1.A17
B_A18  (via drill 0.3)
  Top 0.2: IC3.17 16.34,47.69 15.24,46.58 15.24,41.76 v13.84,40.36
  Bottom 0.2: J1.A12 6.6,39.85 11.68,39.85 12.19,40.36 v13.84,40.36
B_A19  (via drill 0.3)
  Top 0.2: IC3.18 16.47,46.42 16,45.95 16,41.25 v14.22,39.47
  Bottom 0.2: J1.C12 13.34,38.58 v14.22,39.47
B_A20
  Bottom 0.2: J1.B2 9.14,11.91 19.81,11.91 22.61,14.71 22.61,34.52 22.39,34.74 IC6.29
B_A21
  Bottom 0.2: J1.B3 9.14,14.45 20.07,14.45 22.1,16.48 22.1,33.63 21.59,34.14 IC6.30
B_A22
  Bottom 0.2: J1.B4 9.14,16.99 19.43,16.99 21.59,19.15 21.59,32.99 20.79,33.8 IC6.31
B_A23
  Bottom 0.2: J1.B5 9.14,19.53 12.45,19.53 13.72,18.26 19.3,18.26 21.08,20.04 21.08,32.23 19.98,33.33 IC6.32
B_A24
  Bottom 0.2: J1.C10 13.46,33.5 13.84,33.88 18.16,33.88 19.18,34.91 IC6.33
B_A25
  Bottom 0.2: J1.C11 10.41,36.93 10.79,37.31 13.08,37.31 13.72,37.95 14.22,37.95 15.11,38.84 15.11,40.49 15.6,40.97 IC6.36
B_A26
  Bottom 0.2: J1.A14 6.6,44.93 12.06,44.93 12.57,44.42 12.57,43.92 13.12,43.37 IC6.39
B_A27
  Bottom 0.2: IC6.40 13.97,44.17 11.94,46.2 J1.C15
B_A28
  Bottom 0.2: IC6.41 14.19,44.97 J1.C16
B_A29
  Bottom 0.2: J1.A19 6.6,55.09 11.18,55.09 11.68,54.58 11.68,48.49 14.4,45.77 IC6.42
B_D0
  Top 0.2: IC1.17 15.29,15.14 13.34,13.18 J1.C2
B_D1
  Top 0.2: J1.C14 11.68,43.66 12.57,42.77 12.57,41.38 13.08,40.87 13.08,39.22 13.84,38.46 15.75,38.46 16.18,38.89 IC2.11
B_D2
  Top 0.2: IC1.13 13.9,20.22 13.21,19.53 13.21,18.64 12.83,18.26 J1.C4
B_D3
  Top 0.2: IC1.14 14.91,18.95 12.95,16.99 6.6,16.99 J1.A4
B_D4
  Top 0.2: IC1.12 12.39,21.49 11.81,22.07 6.6,22.07 J1.A5
B_D5
  Top 0.2: IC1.18 15.29,13.87 13.34,11.91 6.6,11.91 J1.A2
B_D6
  Top 0.2: IC1.16 14.91,16.41 12.95,14.45 6.6,14.45 J1.A3
B_D7
  Top 0.2: IC1.15 14.79,17.68 12.83,15.72 J1.C3
B_D8
  Top 0.2: IC1.11 14.04,22.76 12.19,24.61 8.13,24.61 7.87,24.36 J1.B6
B_D9
  Top 0.2: IC2.18 15.67,30 14.86,29.18 14.86,27.91 14.1,27.15 9.14,27.15 J1.B7
B_D10
  Top 0.2: IC2.17 15.42,31.27 13.84,29.69 9.14,29.69 J1.B8
B_D11
  Top 0.2: IC2.16 15.93,32.54 15.49,32.11 9.02,32.11 J1.B9
B_D12
  Top 0.2: IC2.15 13.54,33.81 12.7,34.65 9.02,34.65 J1.B10
B_D13
  Top 0.2: IC2.14 15.32,35.08 14.86,35.53 12.95,35.53 11.18,37.31 9.14,37.31 J1.B11
B_D14
  Top 0.2: J1.B12 9.14,39.85 11.43,39.85 11.81,39.47 11.81,37.31 12.78,36.35 IC2.13
B_D15
  Top 0.2: IC2.12 12.78,37.62 12.45,37.95 12.45,40.49 11.94,41 11.94,41.88 11.43,42.39 8.26,42.39 7.87,42.01 J1.B13
B_IOR
  Bottom 0.2: J1.A27 6.6,75.41 11.43,75.41 12.45,74.4 12.45,62.08 13.59,60.93 16.64,60.93 18.92,58.65 18.92,56.49 20.79,54.63 IC6.3
B_MEMR
  Bottom 0.2: J1.C30 13.21,84.3 15.11,82.4 15.11,63.35 15.49,62.97 17.65,62.97 20.95,59.66 20.95,57.51 23.98,54.48 IC6.7
B_RD
  Top 0.2: IC5.15 11.2,69.85 J1.C24
B_RESET
  Bottom 0.2: J1.C31 13.21,86.84 15.88,84.18 15.88,64.49 16.51,63.86 17.78,63.86 21.72,59.92 21.72,57.89 24.79,54.82 IC6.8
B_WR
  Top 0.2: IC5.16 12.86,68.58 12.06,67.79 12.06,65.63 J1.C22
CLK
  Top 0.2: IC7.32 94.02,49.19 94.46,48.74 102.72,48.74
  Top 0.61: 102.72,48.74 R6.1
D0
  Top 0.2: IC1.3 29.64,13.87 36.1,20.33 69.31,20.33 75.32,26.33 IC7.178
D1
  Top 0.2: IC2.9 36.21,37.62 37.21,36.62 37.21,30.45 39.75,27.91 63.62,27.91 64.82,29.12 IC7.157
D2
  Top 0.2: IC1.7 29.73,18.95 33.15,22.37 68.14,22.37 73.32,27.56 IC7.174
D3
  Top 0.2: IC1.6 29.87,17.68 34.05,21.86 68.37,21.86 73.82,27.31 IC7.175
D4
  Top 0.2: IC7.173 72.82,27.79 67.94,22.91 32.26,22.89 29.59,20.22 IC1.8
D5
  Top 0.2: IC1.2 29.65,12.6 36.86,19.81 69.68,19.81 75.82,25.96 IC7.179
D6
  Top 0.2: IC1.4 29.76,15.14 35.46,20.84 68.97,20.84 74.82,26.69 IC7.177
D7
  Top 0.2: IC1.5 29.88,16.41 34.82,21.35 68.6,21.35 74.32,27.07 IC7.176
D8
  Top 0.2: IC7.170 71.32,27.81 66.92,23.41 31.49,23.4 29.58,21.49 IC1.9
D9
  Top 0.2: IC2.2 29.99,28.73 30.99,27.73 30.99,26.91 33.53,24.37 66.18,24.37 70.32,28.5 IC7.168
D10
  Top 0.2: IC2.3 30.88,30 31.88,29 31.88,27.41 34.42,24.87 65.95,24.87 69.82,28.74 IC7.167
D11
  Top 0.2: IC2.4 31.77,31.27 32.77,30.27 32.77,27.92 35.31,25.38 64.94,25.38 68.32,28.76 IC7.164
D12
  Top 0.2: IC2.5 32.66,32.54 33.66,31.54 33.66,28.3 36.07,25.89 64.69,25.89 67.82,29.01 IC7.163
D13
  Top 0.2: IC2.6 33.42,33.81 34.42,32.81 34.42,28.93 36.96,26.39 64.38,26.39 66.32,28.33 IC7.160
D14
  Top 0.2: IC2.7 34.43,35.08 35.43,34.08 35.43,29.44 37.97,26.9 64,26.9 65.82,28.72 IC7.159
D15
  Top 0.2: IC2.8 35.2,36.35 36.2,35.35 36.2,29.95 38.73,27.41 63.74,27.41 65.32,28.98 IC7.158
DIR
  Top 0.2: IC1.1 25.4,11.33 25.27,11.4 24.26,12.42 24.26,22.33 26.04,24.1 26.04,26.82 26.67,27.46 IC2.1 29.61,27.46 30.21,26.85 30.21,25.32 31.67,23.86 66.55,23.86 70.82,28.13 IC7.169
DMACK  (via drill 0.3)
  Top 0.2: 137.22,34.9 134.68,34.9 133.97,35.6 CON1.44 115.41,35.6 v114.94,36.07
  Top 0.61: R16.1 v137.09,34.9 137.22,34.9
  Bottom 0.2: JP15.1 140.11,55.73 139.65,55.27 139.65,55.01 139.26,54.63 138.88,54.63 138.5,54.25 138.5,35.54 137.86,34.9 v137.09,34.9 | v114.94,36.07 114.94,35.05 114.3,34.41 113.86,34.41 X1.29
ETH_CS
  Top 0.2: IC7.20 100.3,43.19 101.76,44.65 JP8.1
  Bottom 0.2: JP8.1 103.04,49.64 94.72,57.96 94.72,80.1 96.13,81.51 100.61,81.51 101.36,82.26 IC12.9
ETH_INT  (via drill 0.3)
  Top 0.2: IC7.21 99.39,43.69 JP9.1 | v93.95,74.73 93.95,74.98 94.72,75.75 v97.54,75.75
  Bottom 0.2: JP9.1 100.48,46.18 99.84,46.82 99.84,51.56 93.95,57.45 v93.95,74.73 | v97.54,75.75 97.92,75.75 98.56,76.39 100.99,76.39 101.47,75.91 IC12.4
F_020_A0
  Top 0.2: IC3.5 33.7,48.96 40.97,41.69 IC7.140
F_020_A1
  Top 0.2: IC3.6 33.56,50.23 41.59,42.19 IC7.139
F_INT  (via drill 0.3)
  Top 0.2: v52.18,54.71 55.24,54.71 56.27,53.69 IC7.116
  Bottom 0.2: IC6.22 34.95,39.37 36.7,41.12 48.25,41.12 50.79,43.66 50.79,54.08 51.42,54.71 v52.18,54.71
F_IORQ  (via drill 0.3)
  Top 0.2: v52.31,57.38 57.4,57.38 59.09,55.69 IC7.112
  Bottom 0.2: IC6.16 30.1,44.17 30.61,43.66 35.83,43.66 36.33,44.17 46.22,44.17 48.76,46.71 48.76,56.74 49.39,57.38 v52.31,57.38
F_IRQ0  (via drill 0.3)
  Top 0.2: v51.3,55.47 55.88,55.47 57.16,54.19 IC7.115
  Bottom 0.2: IC6.21 34.61,40.17 36.2,41.76 47.74,41.76 50.28,44.3 50.28,54.84 50.91,55.47 v51.3,55.47
F_IRQ1  (via drill 0.3)
  Top 0.2: v52.31,56.11 56.39,56.11 57.81,54.69 IC7.114
  Bottom 0.2: IC6.20 34.42,40.97 34.42,41 35.69,42.27 47.23,42.27 49.77,44.81 49.77,55.47 50.41,56.11 v52.31,56.11
F_LDS_SIZ1  (via drill 0.3)
  Top 0.2: v51.17,58.01 57.83,58.01 59.66,56.19 IC7.111
  Bottom 0.2: IC6.14 30.43,45.77 31.37,46.71 45.75,46.71 48.25,49.21 48.25,57.38 48.88,58.01 v51.17,58.01
F_MEMRQ  (via drill 0.3)
  Top 0.2: v52.18,58.65 58.55,58.65 60.51,56.69 IC7.110
  Bottom 0.2: IC6.13 30.21,46.57 31.11,47.47 45.08,47.47 47.61,50 47.61,58.01 48.25,58.65 v52.18,58.65
F_NMI  (via drill 0.3)
  Top 0.2: IC7.118 53.95,52.69 v52.82,53.82
  Bottom 0.2: v52.82,53.82 52.06,53.82 51.42,53.19 51.42,43.03 48.88,40.49 37.47,40.49 36.2,39.22 36.2,38.46 35.31,37.57 IC6.23
F_RD  (via drill 0.3)
  Top 0.2: IC5.5 36.2,68.58 38.73,66.04 v38.73,65.25 | IC7.105 62.2,61.42 60.91,62.71 v44.1,62.71
  Bottom 0.2: v38.73,65.25 39.24,64.74 39.24,63.35 39.88,62.71 v44.1,62.71
F_RESET  (via drill 0.3)
  Top 0.2: IC7.8 94.85,37.19 v95.25,36.79 95.72,36.33 97.28,36.33 98.89,37.94 99.93,37.94 JP16.1 100.35,38.3 100.35,37.35 100.61,37.09 100.61,36.71 100.95,36.36 R19.2
  Bottom 0.2: IC6.28 23.18,35.08 23.11,34.9 23.11,21.26 25.73,18.64 42.73,18.64 51.07,26.98 59.26,26.98 63.23,30.95 93.97,30.95 95.25,32.23 v95.25,36.79 | JP16.1 100.32,39.81 99.84,40.29 99.33,40.29 98.69,40.93 98.69,42.98 99.2,43.49 99.2,50.79 94.46,55.53 94.08,55.91 93.18,56.81 93.18,81.77 94.34,82.92 R43.2
  Bottom 0.61: JP30.1 97.74,85.28 R43.2
F_TCK  (via drill 0.3)
  Top 0.2: IC7.127 59.73,48.19 v58.62,47.08
  Bottom 0.2: R8.2 56.52,32.29 SV2.1 56.22,33.41 58.62,35.81 v58.62,47.08
F_TDI  (via drill 0.3)
  Top 0.2: IC7.128 60.13,47.69 59.52,47.08 59.52,46.69 59.01,46.18 56.32,46.18 v55.94,45.8
  Bottom 0.2: SV2.5 51.14,35.75 52.48,37.09 53.63,37.09 55.94,39.4 v55.94,45.8
F_TDO  (via drill 0.3)
  Top 0.2: IC7.129 60.65,47.19 60.16,46.69 60.16,45.8 59.52,45.16 55.04,45.16 v54.66,45.54
  Bottom 0.2: SV2.7 48.6,35.39 50.82,37.61 53.25,37.61 54.66,39.01 v54.66,45.54
F_TMS  (via drill 0.3)
  Top 0.2: IC7.126 58.57,48.69 v57.34,47.46
  Bottom 0.2: v57.34,47.46 57.34,35.65 SV2.3
F_UDS_SIZ0  (via drill 0.3)
  Top 0.2: v51.17,56.74 56.9,56.74 58.45,55.19 IC7.113
  Bottom 0.2: v51.17,56.74 49.9,56.74 49.26,56.11 49.26,45.69 46.72,43.15 31.24,43.15 30.66,42.57 IC6.18
F_WAIT  (via drill 0.3)
  Top 0.2: IC7.120 53.3,51.69 v52.18,52.81
  Bottom 0.2: v52.18,52.81 52.06,52.68 52.06,42.27 49.52,39.73 38.48,39.73 37.21,38.46 37.21,34.77 35.94,33.5 24.61,33.5 23.98,34.13 IC6.27
F_WR  (via drill 0.3)
  Top 0.2: v52.83,59.41 v52.83,59.42 58.8,59.41 59.52,58.69 IC7.106 | IC5.4 35.56,67.31 38.1,64.77 v38.1,63.47
  Bottom 0.2: v38.1,63.47 38.1,61.95 40.64,59.41 v52.83,59.41
GND  (via drill 0.3)
  Top 0.2: 64.65,51.16 v64.77,51.28 64.77,52.07 64.65,52.19 IC7.119 | IC11.15 63.91,6.25 63.72,6.45 62.31,6.45 C32.2 | 39.24,10.18 C38.2 | v24.77,25.25 24.63,25.24 | IC1.10 25.96,22.76 v25.4,22.2 | IC3.10 31.84,55.31 33.66,57.12 33.66,59.3 SV1.2 | 21.59,63.86 v21.59,63.73 21.59,63.6 21.69,63.5 | IC3.19 19.52,45.15 v20.83,46.46 | R4.1 18.48,7.41 v18.41,7.47 | IC2.10 30.43,38.89 v30.86,38.46 | v91.26,56.8 v91.26,56.81 91.65,57.19 IC7.48 | IC7.190 81.32,31.94 81.02,32.23 80,32.23 79.62,32.61 79.62,33.13 79.23,33.51 v78.59,33.51 | IC7.37 91.91,51.69 91.65,51.43 91.65,50.92 91.39,50.66 v90.5,50.66 | IC7.24 95.13,45.19 v95.49,45.54 | IC7.71 81.32,60.74 81.66,60.39 82.3,60.39 82.55,60.14 | IC7.90 71.82,60.62 v71.12,59.92 | IC7.100 66.82,63.34 v67.07,63.59 | IC7.96 68.82,63.29 v69.12,63.59 | IC7.203 87.82,29.53 v88.06,29.29 | IC7.154 63.59,34.69 63.87,34.41 63.87,33.89 64,33.77 64.38,33.77 v65.02,33.13 66.56,33.13 66.82,32.87 IC7.161 | IC7.109 64.2,57.19 v64.52,56.87 | CON1.50 130.16,43.23 v130.3,43.24 | CON1.10 127.5,23.54 v127.87,23.91 127.87,24.55 127.61,24.81 | CON1.11 127.61,24.81 | CON1.12 127.62,26.08 127.87,25.83 127.87,25.07 127.61,24.81 | CON1.8 127.07,21 v127.49,20.58 | CON1.17 127.42,32.43 127.74,32.1 v127.74,31.72 127.74,31.46 127.44,31.16 CON1.16 | CON1.14 127.51,28.62 v127.74,28.39 | CON1.15 132.52,29.89 v133.63,28.77 | CON1.1 124.58,11.33 v124.67,11.24 | C67.1 C66.1 | C66.1 v151.04,17.38 152.83,17.38 C48.2 | 140.27,26.47 R17.2 | R49.2 144.05,8.5 v144.51,8.04 | R50.2 145.54,21.99 146.82,20.71 146.82,19.94 147.46,19.3 148.99,19.3 149.3,18.99 C66.1 | X2.1 155.88,60.45 LED1.C | 82.55,60.14 v82.55,59.54
  Top 0.2: IC7.62 85.82,60.58 85.63,60.39 82.8,60.39 82.55,60.14 | IC7.58 87.82,60.38 v88.19,60.01 | IC7.133 63.97,45.19 64.38,44.77 v64.38,44.13 | IC7.143 63.98,40.19 v64.26,39.91 | IC7.171 71.82,32.62 v72.7,33.51 | IC7.199 85.82,32.43 85.5,32.74 84.1,32.74 83.84,33 83.84,33.99 v83.82,33.75 | IC7.165 68.82,32.57 v69.12,32.87 | IC7.3 90.78,34.69 v90.75,34.66 | IC7.14 91.61,40.19 v90.93,40.87
  Top 0.61: C41.2 24.85,8.57 v25.27,8.99 | 24.63,25.24 C36.2 | IC5.19 20.67,64.77 21.59,63.86 | IC5.10 29.87,74.93 30.35,75.41 v30.35,76.17 | R5.1 R4.1 | 21.59,63.6 21.59,62.52 20.36,61.29 C37.2 | v25.22,40.17 24.45,40.17 C42.2 | v95.34,12.67 94.62,13.39 C20.- 91.01,11.24 86.02,11.24 85.31,11.94 C39.2 | C53.2 v78.34,14.32 v78.33,14.32 | C52.2 82.2,9.98 81.92,9.7 81.45,9.7 v81.37,9.62 | C32.2 60.58,6.53 v60.16,6.96 | R18.2 140.27,26.47 v141.31,26.47 | 40.74,7.26 39.17,7.26 v39.17,7.28 39.17,8.76 39.24,8.76
  Top 0.813: C13.2 141.66,48.82 v140.43,50.04
  Top 1.27: C9.- 40.74,7.26 | 39.24,8.76 39.24,10.18 | J1.A32 J1.C32
  Bottom 0.15: 86.23,52.17 86.36,52.04 v86.36,52.3
  Bottom 0.2: R8.1 56.85,30.39 56.22,29.76 SV2.2 | 83.82,35.39 C47.2 | 82.55,58.67 C21.2 82.52,58.09 | 85.34,49.03 C4.- | 76.39,38.58 C7.- | 70.87,43.66 C12.- | C31.2 82.55,74.77 | C35.2 31.62,6.71 | C33.2 15.15,35.57 v14.35,34.77 | 58.17,75.29 58.04,75.29 58.04,75.26 C29.2 | C28.2 35.38,44.95 v35.84,45.41 | 61.31,91.62 | C22.- 61.1,93.5 | IC6.25 25.59,36.75 | 88.98,50.66 C25.2 | 116.43,85.35 C64.1 | v102.02,86.25 102.02,86.37 | IC8.34 58.53,76.36 58.64,76.25 58.64,75.7 | IC8.12 59.33,90.65 59.44,90.76 | IC9.12 83.78,90.18 83.73,90.23 | IC9.34 82.98,76.09 82.93,76.04 | 122.81,77.93 C61.1 | 113.31,81 IC12.21 | 130.43,53.46 C55.2 | IC10.1 | J2.6 133.82,46.12 134.53,45.41 134.53,43.62 133.63,42.73 130.82,42.73 v130.3,43.24 130.3,39.27 130.96,38.62 J2.3 | J2.S1 133.22,27.34 133.63,27.75 v133.63,28.77 | C19.- 125.69,13.28 124.67,12.26 v124.67,11.24 | C43.2 66.1,56.87 | 82.46,59.62 v82.55,59.54 | C2.2 | 66.85,39.91 C14.2 66.93,39.96 | 72.8,37.47 72.7,37.37 | C44.2 | 89,34.66 C5.2
  Bottom 0.305: 59.44,90.76 C26.2 | C11.- 83.94,94.02 v83.94,93.46 83.94,91.88 C27.2 83.84,90.34 83.73,90.23
  Bottom 0.406: 82.93,76.04 82.55,75.67 82.55,74.77 | C31.2 82.45,73.54 v82.3,73.38 | 25.59,36.75 25.59,36.34 25.86,36.07 26.75,36.07 27.14,35.68 C23.2 | 58.64,75.7 C29.2 57.91,74.98 v57.91,73.63
  Bottom 0.61: IC4.10 26.15,20.05 25.4,20.8 v25.4,22.2 25.4,24.61 v24.77,25.25 | IC6.25 25.59,39.79 25.27,40.11 v25.22,40.17 | C16.2 15.57,30.21 IC4.19 19.57,30.21 v19.94,30.58 | D3.1 131.89,93.64 v132.33,94.08 | IC6.4 21.59,47.21 v20.83,46.46 | IC6.17 27.65,43.37 27.18,42.9 v27.18,42.39 | D2.1 132.02,73.95 131.06,74.9 v130.3,74.9 | 134.24,83.03 134.37,82.91 C57.1 | D4.1 133.79,83.48 134.24,83.03 | 134.24,83.03 134.24,82.02 133.86,81.64 132.59,81.64 v132.33,81.89 | D1.1 133.92,64.3 134.28,63.94 C56.1 134.28,61.35 v134.24,61.32 | v82.55,59.54 82.55,58.67 | 90.69,56.23 v91.26,56.81 | 86.58,47.79 C4.- | v90.93,40.87 89.16,40.87 C17.2 | v64.77,51.28 66.34,51.28 C45.2 | v64.52,56.87 66.1,56.87 | C40.2 v71.12,59.92 | v90.5,50.66 88.98,50.66 | 116.43,85.35 115.2,85.35 114.65,84.8 IC12.18 111.58,84.8 111.1,84.33 v111.1,81.77 111.87,81 113.31,81 | C64.1 C58.1 | C63.1 v122.88,79.33 C61.1 | IC12.2 101.3,73.37 v100.74,72.81 98.75,70.82 C59.- | IC12.11 102.44,84.8 102.02,85.22 v102.02,86.25 | 102.02,86.37 101.38,87.01 98.18,87.01 97.74,87.45 R44.1 | IC12.21 IC12.22 | C54.2 130.67,54.74 130.43,54.5 130.43,53.46 | C65.1 116.61,71.4 v116.86,71.14 117.17,70.83 C62.1 | C60.1 121.27,78.26 121.6,77.93 122.81,77.93 | C55.2 130.41,52.56 v129.92,52.07 | C30.- 28.92,2.8 v29.18,2.53 | C46.2 33.68,63.11 SV1.2 | IC10.1 39.17,7.41 v39.17,7.28
  Bottom 0.813: v83.82,33.75 83.82,35.39 | 86.33,52.27 86.23,52.17 85.34,51.28 85.34,49.03 | 72.8,37.47 v73.91,38.58 76.39,38.58 | C14.2 69.56,39.95 v70.87,41.12 70.87,43.66 | v140.43,50.04 C18.- | C1.2 79.84,60.55 80.77,59.62 82.46,59.62 | 90.69,56.23 C10.2 | C24.- 80.37,57.18 81.28,58.09 82.52,58.09 | v64.38,44.13 65.92,44.13 66.18,44.39 C2.2 | v64.26,39.91 66.85,39.91 | C8.2 66.93,39.96 | 72.7,37.37 C44.2 | v72.7,33.51 C44.2 | C6.2 78.17,33.93 v78.59,33.51 | v90.75,34.66 89,34.66 | C3.2 86.58,47.79 | IC13.2 79.72,43 v80.26,42.47 v80.26,41.57
  Bottom 1.016: C15.- 115.21,53.17 114.3,53.99 v114.3,55.87 | C26.2 60.96,91.27 61.31,91.62 | C22.- 61.31,91.62 | 61.1,93.5 v59.14,95.46
  Bottom 1.27: 31.62,6.71 29.84,4.93 C30.- | J1.A32 J1.C32
  other vias: 104.52,56.12 97.03,47.73 101.09,47.73 101.47,49.5 114.68,49.78 103.25,51.03
  pour Top: 94.61,49.25 95.25,49.89 101.35,49.89 103.76,52.3 103.76,56.26 105.03,57.52 113.79,57.52 115.44,56.13 115.32,49.14 113.16,46.98 111.97,46.98 99.06,46.96 95.38,46.96 94.61,47.85
  pour GND$: 0,0 159.26,0 159.26,100.03 0,100.03
IDE_CS0  (via drill 0.3)
  Top 0.2: IC7.205 88.82,29.17 89.86,28.13 97.54,28.13 100.35,25.32 106.62,25.32 107.52,24.42 116.1,24.42 v116.48,24.04 120.79,19.73 CON1.7
  Bottom 0.2: v116.48,24.04 116.48,40.29 115.35,41.42 X1.37
IDE_CS1  (via drill 0.3)
  Top 0.2: IC7.206 89.32,29.44 90.24,28.52 97.92,28.52 99.46,26.98 105.86,26.98 107.65,25.19 v109.06,25.19 | CON1.32 121.43,20.36 117.25,24.55 v117.25,25.19
  Bottom 0.2: X1.38 111.79,42.34 115.46,42.34 117.25,40.55 v117.25,25.19 117.25,23.53 116.61,22.89 115.2,22.89 114.82,23.27 114.82,23.91 114.3,24.42 109.82,24.42 v109.06,25.19
IDE_D0  (via drill 0.3)
  Top 0.2: X1.17 112.2,21.42 111.23,20.45 102.78,20.45 96.51,26.73 87.55,26.73 86.82,27.46 IC7.201 | CON1.21 118.05,37.51 v118.02,37.48
  Bottom 0.2: v118.02,37.48 118.02,21.86 117.58,21.42 X1.17
IDE_D1  (via drill 0.3)
  Top 0.2: X1.15 112.25,19.42 111.23,18.41 102.78,18.41 95.74,25.45 85.76,25.45 84.82,26.39 IC7.197 | CON1.22 122,38.78 121.34,38.12 119.42,38.12 118.78,38.76 v118.78,39.27
  Bottom 0.2: v118.78,39.27 118.78,20.33 117.88,19.42 X1.15
IDE_D2  (via drill 0.3)
  Top 0.2: X1.13 112.17,17.42 111.23,16.49 102.53,16.49 94.85,24.17 84.48,24.17 83.82,24.83 IC7.195 | CON1.23 120.05,40.05 v119.55,40.55
  Bottom 0.2: v119.55,40.55 119.55,18.92 118.06,17.42 X1.13
IDE_D3
  Top 0.2: CON1.2 119.2,13.38 117.16,15.42 X1.11 112.22,15.42 111.23,14.44 102.78,14.44 94.08,23.01 83.71,23.01 82.82,23.91 IC7.193
IDE_D4
  Top 0.2: CON1.3 127.53,14.65 128.51,13.67 128.51,10.98 127.62,10.09 119.17,10.09 115.84,13.41 114.42,13.41 X1.9 112.26,13.42 111.23,12.39 103.17,12.39 93.57,21.99 82.3,21.99 80.82,23.48 IC7.189
IDE_D5
  Top 0.2: CON1.4 128.18,15.92 129.15,14.95 129.15,10.47 128.26,9.57 117.89,9.57 116.04,11.42 X1.7 112.18,11.42 111.1,10.34 103.42,10.34 92.93,20.84 80.51,20.84 79.82,21.53 IC7.187
IDE_D6
  Top 0.2: CON1.5 130.5,17.19 131.84,15.85 131.84,7.4 130.18,5.73 124.29,5.73 123.39,6.63 123.39,7.78 122.75,8.42 117.63,8.42 116.63,9.42 X1.5 112.23,9.42 111.23,8.42 103.68,8.42 92.54,19.56 79.49,19.56 78.82,20.23 IC7.185
IDE_D7
  Top 0.2: CON1.6 131.27,18.46 132.74,17 132.74,6.89 130.82,4.97 123.65,4.97 121.19,7.42 X1.3 112.79,7.42 111.74,6.37 103.94,6.37 92.03,18.28 78.72,18.28 77.82,19.18 IC7.183
IDE_D8  (via drill 0.3)
  Top 0.2: CON1.47 121.49,39.42 v121.34,39.4 | X1.4 103.78,7.42 92.29,18.92 79.23,18.92 78.32,19.83 IC7.184
  Bottom 0.2: X1.4 111.87,8.42 115.33,8.42 122.37,15.46 122.37,38.37 v121.34,39.4
IDE_D9  (via drill 0.3)
  Top 0.2: CON1.48 v121.35,40.69 v121.34,40.68 | X1.6 103.45,9.42 92.67,20.2 80.13,20.2 79.32,21.01 IC7.186
  Bottom 0.2: X1.6 111.92,10.47 116.22,10.47 120.58,14.82 120.58,39.91 v121.34,40.68
IDE_D10  (via drill 0.3)
  Top 0.2: CON1.49 v121.35,41.95 v121.34,41.96 | X1.8 103.24,11.42 93.18,21.48 81.15,21.48 80.32,22.31 IC7.188
  Bottom 0.2: X1.8 111.97,12.52 116.86,12.52 120.06,15.72 120.06,40.04 120.58,40.55 120.58,41.19 v121.34,41.96
IDE_D11
  Top 0.2: CON1.27 127.14,14.01 127.74,13.41 127.74,11.37 126.98,10.6 120.32,10.6 116.48,14.44 111.89,14.44 X1.10 102.9,13.42 93.82,22.5 83.33,22.5 82.32,23.51 IC7.192
IDE_D12
  Top 0.2: CON1.28 119.09,15.28 117.89,16.49 111.94,16.49 X1.12 102.7,15.42 94.59,23.53 84.22,23.53 83.32,24.43 IC7.194
IDE_D13
  Top 0.2: CON1.29 119.23,16.56 117.38,18.41 111.81,18.41 X1.14 102.62,17.42 95.23,24.81 84.74,24.81 84.32,25.22 IC7.196
IDE_D14
  Top 0.2: 108.3,19.42 X1.16 112.02,20.45 116.74,20.45 119.36,17.83 CON1.30 | 108.3,19.42 108.29,19.43 | 108.3,19.42 102.79,19.42 96.13,26.09 86.27,26.09 85.32,27.04 IC7.198
IDE_D15
  Top 0.2: CON1.31 119.89,19.09 116.48,22.5 111.97,22.5 X1.18 102.84,21.42 97.02,27.24 87.94,27.24 87.32,27.86 IC7.202
IDE_DASP  (via drill 0.3)
  Top 0.2: 138.37,39.66 R20.1 | 138.37,38.5 136.7,38.5 135.08,36.88 CON1.45 116.57,36.88 v114.94,38.5
  Top 0.61: 138.37,39.66 138.37,38.5 R15.1
  Bottom 0.2: v114.94,38.5 113.54,38.5 113.41,38.37 112.13,38.37 111.87,38.12 111.87,37.61 111.69,37.42 X1.34
IDE_IA0  (via drill 0.3)
  Top 0.2: IC7.7 94.23,36.69 95.1,35.81 97.66,35.81 98.77,36.92 v99.85,36.92 | CON1.20 116.06,36.24 X1.35
  Bottom 0.2: v99.85,36.92 107.22,36.92 108.29,37.99 109.82,37.99 110.34,38.5 111.36,38.5 111.87,39.01 112.46,39.01 X1.35
IDE_IA1  (via drill 0.3)
  Top 0.2: IC7.6 93.96,36.19 94.85,35.3 98.05,35.3 98.65,35.91 v99.86,35.91 | CON1.19 114.89,34.97 114.05,35.81 114.05,36.25 X1.33
  Bottom 0.2: v99.86,35.91 109.28,35.91 109.82,36.45 111.9,36.45 X1.33
IDE_IA2
  Top 0.2: IC7.2 98.78,34.19 100.61,32.36 111.36,32.36 111.87,32.87 | CON1.18 118.46,33.7 116.99,32.23 113.79,32.23 113.66,32.36 112.38,32.36 111.87,32.87 | 111.87,32.87 111.87,38.42 X1.36
IDE_INT  (via drill 0.3)
  Top 0.2: CON1.37 120.84,26.72 119.81,27.75 119.81,28.9 118.27,30.44 v101.76,30.44 98.18,30.44 97.15,31.46 97.15,32.61 96.08,33.69 IC7.1
  Bottom 0.2: X1.31 112.25,35.42 111.23,34.41 106.24,34.41 105.34,35.3 102.27,35.3 101.76,34.79 v101.76,30.44
IDE_IOCS16  (via drill 0.3)
  Top 0.2: R11.1 136.1,44.68 132.74,41.32 CON1.24 116.74,41.32 v115.46,40.04
  Bottom 0.2: X1.30 111.86,34.41 113.28,34.41 114.18,35.3 114.18,37.35 114.56,37.73 115.33,37.73 115.84,38.25 115.84,39.65 v115.46,40.04
IDE_IORDY
  Top 0.2: R10.1 134.78,32.49 134.21,33.06 CON1.42 118.72,33.06 117.38,31.72 114.05,31.72 113.75,31.42 X1.27
IDE_PDIAG
  Top 0.2: CON1.46 130.84,38.14 134.96,42.27 R14.1
IDE_PRESENT
  Top 0.2: CON1.25 133.24,42.59 133.89,43.24 133.89,50.92 134.27,51.3 138.62,51.3 140.03,52.71 140.03,60.9 141.09,61.96 R21.1
IDE_RD
  Top 0.2: CON1.34 120.81,22.9 116.3,27.42 X1.23 111.92,26.47 108.8,26.47 107.78,27.49 99.84,27.49 98.3,29.03 90.62,29.03 89.82,29.84 IC7.207
IDE_VS1
  Top 0.2: CON1.33 133.79,21.63 134.4,22.25 135.81,22.25 136.7,23.14 141.35,23.14 R12.1
IDE_VS2
  Top 0.2: CON1.40 132.65,30.52 133.1,30.07 R13.1
IDE_WR
  Top 0.2: IC7.208 90.32,29.98 90.75,29.54 98.69,29.54 99.84,28.39 111.87,28.39 112.87,29.39 X1.25 116.09,29.42 121.33,24.18 CON1.35
IRQ0
  Bottom 0.2: J1.B21 9.14,60.17 11.81,60.17 12.32,59.66 15.88,59.66 17.4,58.14 17.4,55.85 19.18,54.07 IC6.1
IRQ1
  Bottom 0.2: J1.B20 9.14,57.63 11.56,57.63 12.32,56.87 12.32,49.12 14.87,46.57 IC6.43
KEY_CLK  (via drill 0.3)
  Top 0.2: IC7.45 95.2,55.69 96.26,56.74 96.26,62.06 98.69,64.49 120.19,64.49 124.98,69.27 124.98,70.04 v125.7,70.76
  Bottom 0.2: 132.93,70.33 D2.3
  Bottom 0.61: 132.93,70.33 131.44,70.33 131,70.78 R34.1 125.7,70.78 v125.7,70.76
KEY_DAT  (via drill 0.3)
  Top 0.2: IC7.44 95.72,55.19 97.02,56.49 97.02,61.92 99.07,63.97 120.7,63.97 125.1,68.37 125.36,68.37 125.7,68.71 v125.7,69.48
  Bottom 0.2: R33.1 129.98,67.41
  Bottom 0.61: D1.3 131.66,67.75 131.32,67.41 129.98,67.41 | R33.1 126.93,67.47 125.7,68.71 v125.7,69.48
LED_A  (via drill 0.3)
  Top 0.2: J4.10 136.27,24.29 136.83,24.29 137.22,23.91 141.18,23.91 142.08,24.81 142.08,26.09 143.1,27.11 147.2,27.11 150.53,30.44 v150.53,35.05
  Bottom 0.2: IC12.27 111.79,73.37 111.23,72.81 111.23,67.05 112.13,66.15 126.08,66.15 131.58,60.65 146.94,60.65 150.53,57.06 v150.53,35.05
LED_B
  Bottom 0.2: IC12.26 111.14,74.64 110.59,74.09 110.59,66.66 111.87,65.38 125.95,65.38 131.33,60.01 146.56,60.01 149.38,57.19 149.38,30.82 152.06,28.13 153.09,28.13 154.37,26.85 154.37,16.1 151.81,13.54 146.3,13.54 141.82,9.06 137.73,9.06 J4.8
MOUSE_CLK  (via drill 0.3)
  Top 0.2: v125.09,85.95 125.09,72.38 124.47,71.75 124.47,69.74 119.73,65 98.3,65 95.62,62.32 95.62,57 94.81,56.19 IC7.46
  Bottom 0.2: 129.69,87.31 R36.1 129.48,87.1
  Bottom 0.61: 129.69,87.31 D4.3 | 129.48,87.1 126.24,87.1 v125.09,85.95
MOUSE_DAT  (via drill 0.3)
  Top 0.2: v126.11,90.14 125.09,90.14 123.95,89 123.95,70.13 119.36,65.51 97.79,65.51 94.98,62.69 94.98,57.7 93.96,56.69 IC7.47
  Bottom 0.2: R35.1 129.69,90.06
  Bottom 0.61: 129.69,90.06 D3.3 | R35.1 126.18,90.21 v126.11,90.14
N$1
  Top 0.2: IC11.1 78.61,4.98 78.79,5.17 C50.2
N$2
  Top 0.2: R20.2 154.14,39.69 155.52,41.06 155.52,49.25 156.42,50.15 156.42,51.17 155.52,52.07 155.52,53.61 156.29,54.37 156.29,56.29 155.65,56.93 155.01,56.93 154.75,57.19 154.32,57.19 LED2.C
N$3
  Top 0.2: IC11.3 78.01,7.52 79.03,6.5 82.05,6.5 82.25,6.3 C50.1
N$4
  Top 0.2: IC11.4 77.63,8.79 79.41,7.01 82.05,7.01 82.25,7.21 C49.2
N$5
  Top 0.2: R6.2 105.39,49.69 | 106.5,52.15 QG1.5
  Top 0.61: 105.39,49.69 106.5,50.79 106.5,52.15
N$6
  Top 0.2: C49.1 79.18,8.35 77.47,10.06 IC11.5
N$7
  Top 0.2: 80.33,11.33 C52.1
  Top 0.813: IC11.6 80.33,11.33
N$8
  Top 0.2: IC11.2 73.31,6.25 72.61,6.95 72.61,13.94 71.59,14.95 64.06,14.95 C51.2
N$9
  Top 0.2: LED3.C 152.49,61.96 152.06,61.54 149.63,61.54 149.21,61.96 R21.2
N$10
  Top 0.2: IC11.8 77,13.87 77.82,13.05 83.28,13.05 83.91,12.41 83.91,10.52 JP18.2
N$11
  Top 0.2: IC11.13 70.52,8.79 71.34,7.97 71.34,4.81 72.48,3.66 90.39,3.66 91.66,4.93 91.66,8.06 JP18.8
N$12
  Top 0.2: IC11.7 77.25,12.6 77.56,12.29 82.9,12.29 83.28,11.91 83.28,8.73 84.04,7.97 86.46,7.97 JP18.3
N$13
  Top 0.2: 136.08,84.07 R23.2 R22.2 R24.2 137.07,83.16 137.98,84.07 J3.1
N$14
  Top 0.2: R27.2 R26.2 R25.2 137.28,80.87 138.18,81.77 J3.2
N$15
  Top 0.2: R9.1 148.63,59.39 149.25,60.01 153.35,60.01 LED1.A
N$16
  Top 0.2: R50.1 139.78,21.99 139.26,22.5 136.93,22.5 J4.9
N$17
  Top 0.2: R30.2 R29.2 R28.2 137.18,74.14 137.92,74.89 137.92,78.86 138.54,79.48 J3.3